# EAGLE design DevBrd (EAGLE 7.7.0)
DOKUMENT: Schaltplan; EDITOR: Simon Diehl; REFERENZ: Developmentboard; STATUS: In Entwicklung

## Sheet 1 of 2
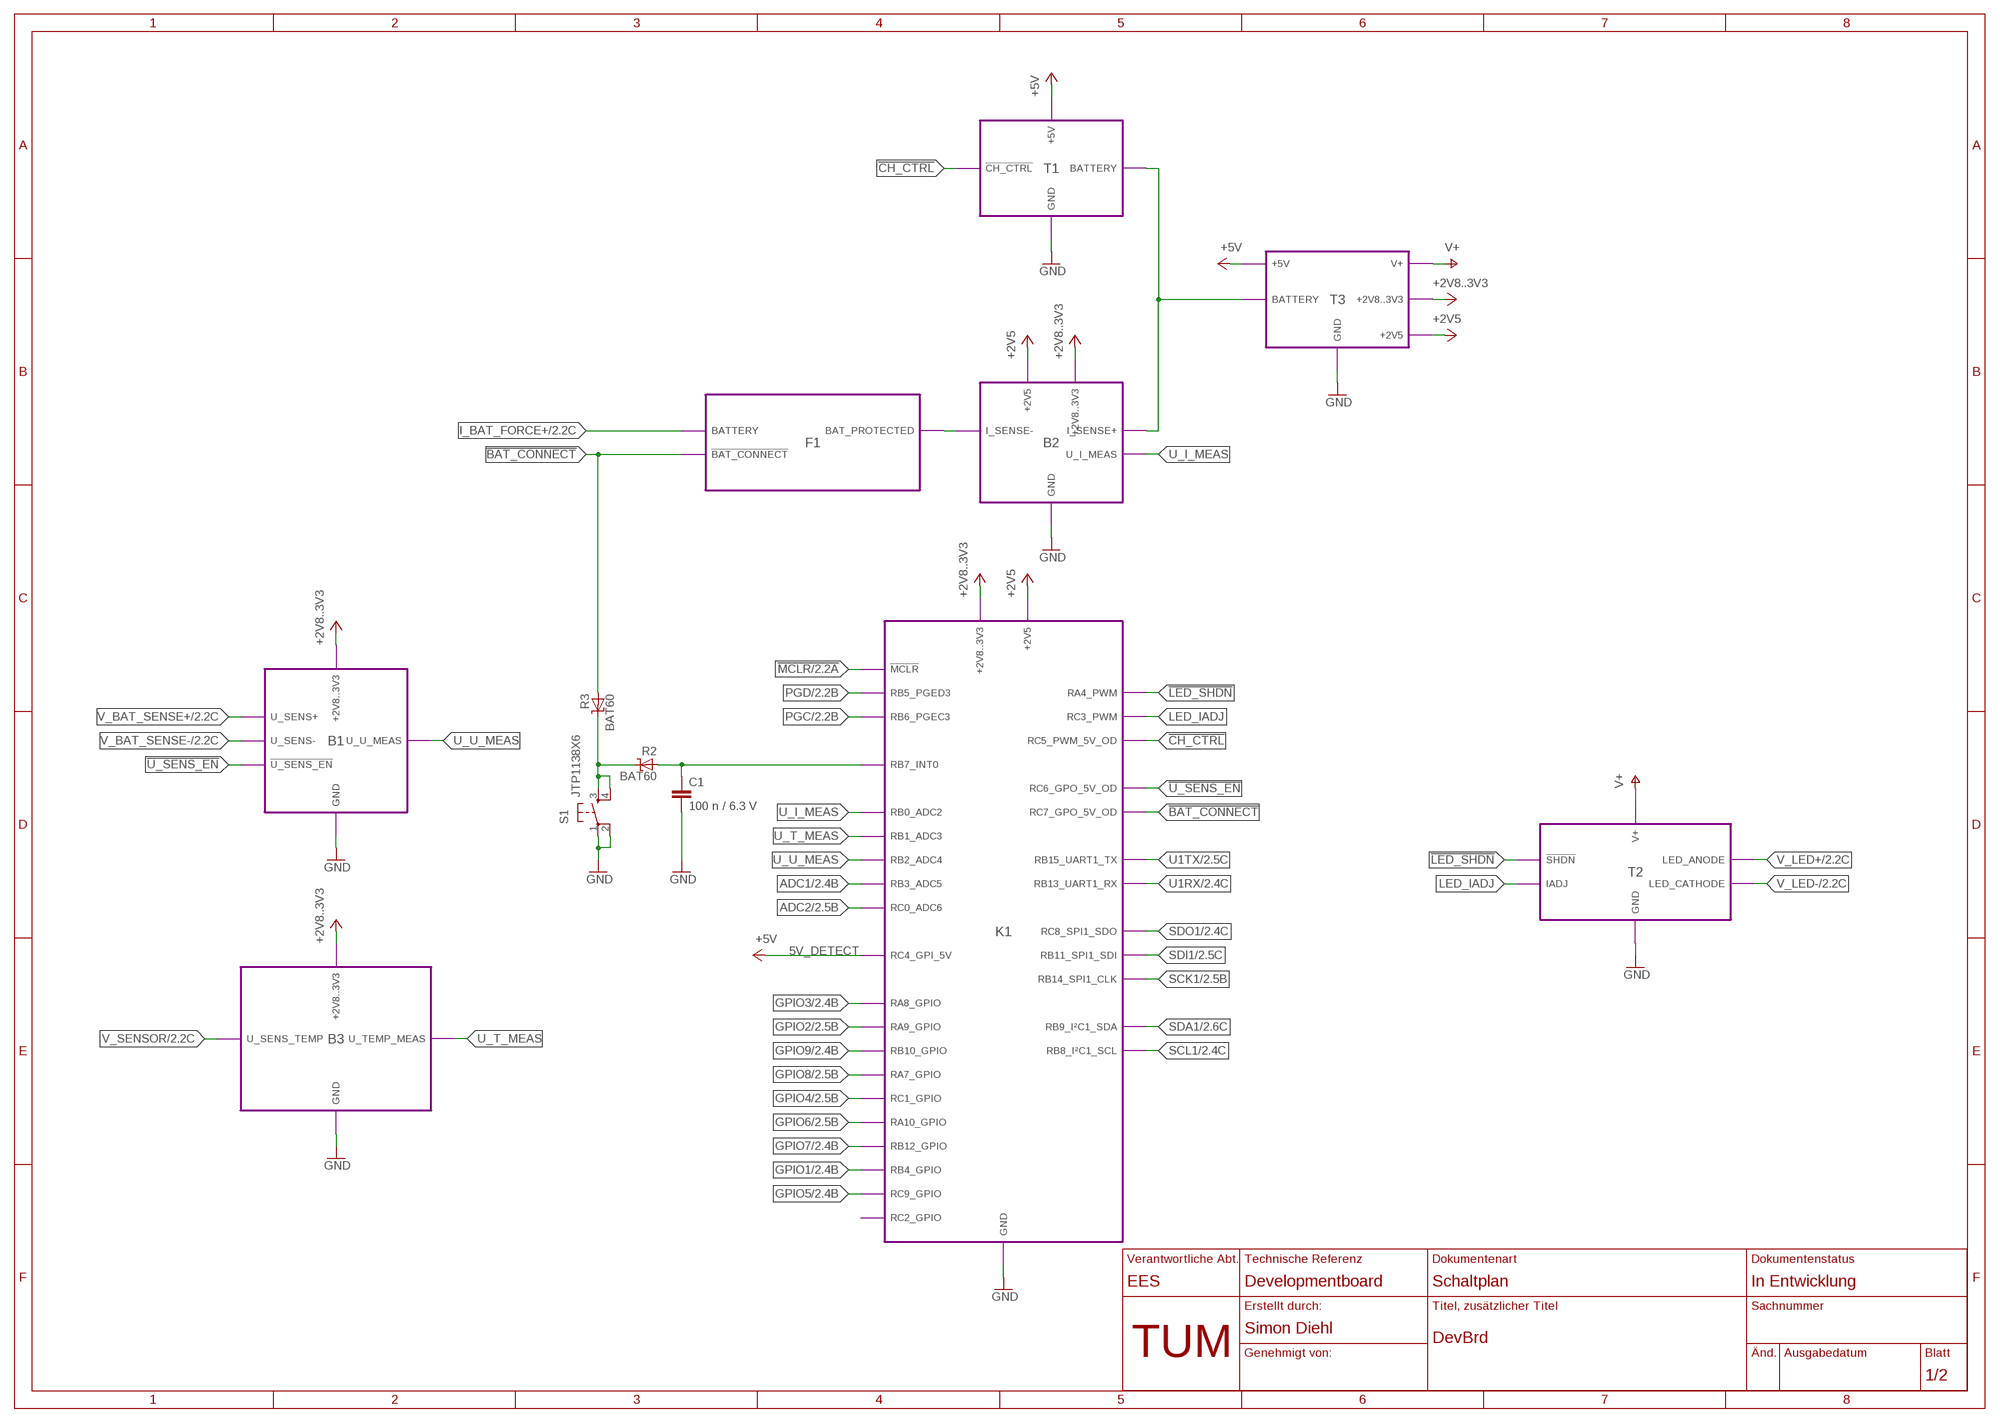
[diagram p0: schematic, sheet 1]

### Parts
C1  100 n / 6.3 V  C-EUC0603  [C0603]
R2  BAT60  [SOD323]
R3  BAT60  [SOD323]
S1  JTP1138X6  [JTP1138X6]

### Module instances
T3 = POWER_SUPPLY
T1 = CHARGER
T2 = LED_DRIVER
B3 = TEMPERATURE_SENSOR
K1 = PIC32MX
B1 = VOLTAGE_SENSOR
B2 = CURRENT_SENSOR
F1 = BATTERY_DISCONNECT

### Nets
!BAT_CONNECT: R3.A ; port F1.!BAT_CONNECT K1.RC7_GPO_5V_OD
!CH_CTRL: port T1.!CH_CTRL K1.RC5_PWM_5V_OD
!LED_SHDN: port K1.RA4_PWM T2.!SHDN
!MCLR: port K1.!MCLR ; also sheet 2
!U_SENS_EN: port B1.!U_SENS_EN K1.RC6_GPO_5V_OD
+2V5: port T3.+2V5 K1.+2V5 B2.+2V5
+2V8..3V3: port T3.+2V8..3V3 B3.+2V8..3V3 B1.+2V8..3V3 K1.+2V8..3V3 B2.+2V8..3V3 ; also sheet 2
+5V: port T3.+5V T1.+5V K1.RC4_GPI_5V ; also sheet 2
ADC1: port K1.RB3_ADC5 ; also sheet 2
ADC2: port K1.RC0_ADC6 ; also sheet 2
GND: C1.2 S1.1(P) S1.2(P1) ; port T3.GND T1.GND B2.GND T2.GND B3.GND B1.GND K1.GND ; also sheet 2
GPIO1: port K1.RB4_GPIO ; also sheet 2
GPIO2: port K1.RA9_GPIO ; also sheet 2
GPIO3: port K1.RA8_GPIO ; also sheet 2
GPIO4: port K1.RC1_GPIO ; also sheet 2
GPIO5: port K1.RC9_GPIO ; also sheet 2
GPIO6: port K1.RA10_GPIO ; also sheet 2
GPIO7: port K1.RB12_GPIO ; also sheet 2
GPIO8: port K1.RA7_GPIO ; also sheet 2
GPIO9: port K1.RB10_GPIO ; also sheet 2
I_BAT_FORCE+: port F1.BATTERY ; also sheet 2
LED_IADJ: port T2.IADJ K1.RC3_PWM
N$1: port F1.BAT_PROTECTED B2.I_SENSE-
N$2: port T1.BATTERY T3.BATTERY B2.I_SENSE+
N$3: C1.1 R2.A ; port K1.RB7_INT0
N$4: R2.C R3.C S1.3(S) S1.4(S1)
PGC: port K1.RB6_PGEC3 ; also sheet 2
PGD: port K1.RB5_PGED3 ; also sheet 2
SCK1: port K1.RB14_SPI1_CLK ; also sheet 2
SCL1: port K1.RB8_I²C1_SCL ; also sheet 2
SDA1: port K1.RB9_I²C1_SDA ; also sheet 2
SDI1: port K1.RB11_SPI1_SDI ; also sheet 2
SDO1: port K1.RC8_SPI1_SDO ; also sheet 2
U1RX: port K1.RB13_UART1_RX ; also sheet 2
U1TX: port K1.RB15_UART1_TX ; also sheet 2
U_I_MEAS: port B2.U_I_MEAS K1.RB0_ADC2
U_T_MEAS: port K1.RB1_ADC3 B3.U_TEMP_MEAS
U_U_MEAS: port B1.U_U_MEAS K1.RB2_ADC4
V+: port T3.V+ T2.V+
V_BAT_SENSE+: port B1.U_SENS+ ; also sheet 2
V_BAT_SENSE-: port B1.U_SENS- ; also sheet 2
V_LED+: port T2.LED_ANODE ; also sheet 2
V_LED-: port T2.LED_CATHODE ; also sheet 2
V_SENSOR: port B3.U_SENS_TEMP ; also sheet 2

### Notes on the sheet
- 5V_DETECT

## Sheet 2 of 2
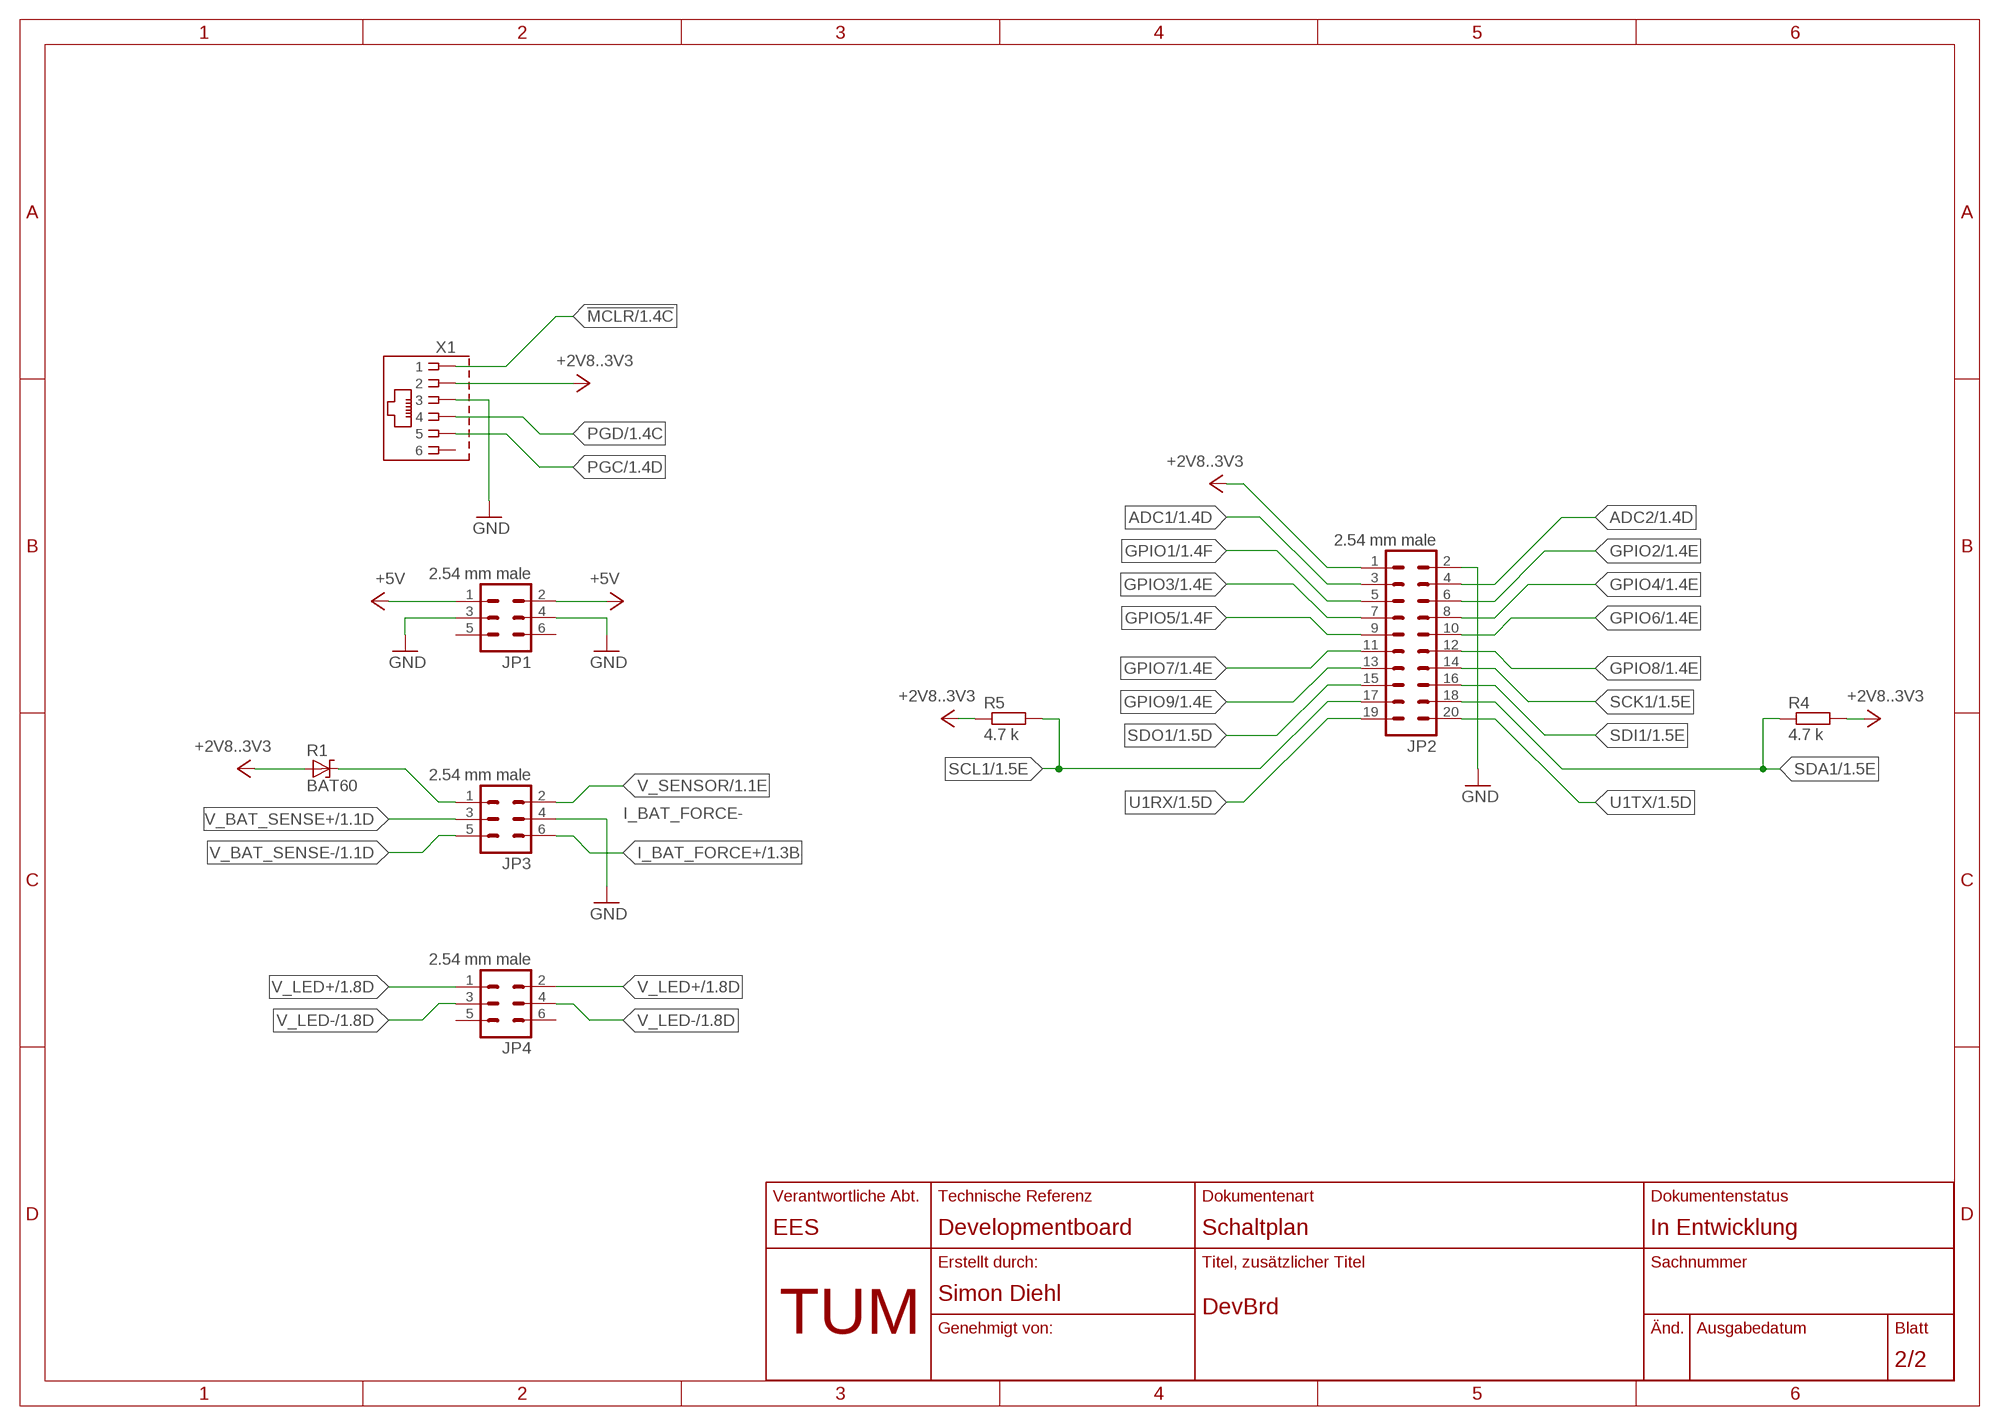
[diagram p1: schematic, sheet 2]

### Parts
JP1  2.54 mm male  ML6  [ML6]
JP2  2.54 mm male  ML20  [ML20]
JP3  2.54 mm male  ML6  [ML6]
JP4  2.54 mm male  ML6  [ML6]
R1  BAT60  [SOD323]
R4  4.7 k  R-EU_R0603  [R0603]
R5  4.7 k  R-EU_R0603  [R0603]
X1  RJ11WüRTH  [XRJK-S-01-6-6-0-2G2-NO]

### Nets
!MCLR: X1.6 ; also sheet 1
+2V8..3V3: JP2.1 R1.A R4.2 R5.1 X1.5 ; also sheet 1
+5V: JP1.1 JP1.2 ; also sheet 1
ADC1: JP2.3 ; also sheet 1
ADC2: JP2.4 ; also sheet 1
GND: JP1.3 JP1.4 JP2.2 JP3.4 X1.4 ; also sheet 1
GPIO1: JP2.5 ; also sheet 1
GPIO2: JP2.6 ; also sheet 1
GPIO3: JP2.7 ; also sheet 1
GPIO4: JP2.8 ; also sheet 1
GPIO5: JP2.9 ; also sheet 1
GPIO6: JP2.10 ; also sheet 1
GPIO7: JP2.11 ; also sheet 1
GPIO8: JP2.12 ; also sheet 1
GPIO9: JP2.13 ; also sheet 1
I_BAT_FORCE+: JP3.6 ; also sheet 1
PGC: X1.2 ; also sheet 1
PGD: X1.3 ; also sheet 1
SCK1: JP2.14 ; also sheet 1
SCL1: JP2.17 R5.2 ; also sheet 1
SDA1: JP2.18 R4.1 ; also sheet 1
SDI1: JP2.16 ; also sheet 1
SDO1: JP2.15 ; also sheet 1
U1RX: JP2.19 ; also sheet 1
U1TX: JP2.20 ; also sheet 1
V_BAT_SENSE+: JP3.3 ; also sheet 1
V_BAT_SENSE-: JP3.5 ; also sheet 1
V_LED+: JP4.1 JP4.2 ; also sheet 1
V_LED-: JP4.3 JP4.4 ; also sheet 1
V_SENSOR: JP3.2 ; also sheet 1
VDD_SENSOR: JP3.1 R1.C
Unconnected: JP1.5 JP1.6 JP4.5 JP4.6 X1.1

### Notes on the sheet
- I_BAT_FORCE-

## Library data of the parts
C1 = rcl:C-EU: CAPACITOR, European symbol
JP1 JP3 JP4 = Development_Board:ML6: HARTING; OC_FARNELL: unknown; OC_NEWARK: unknown
JP2 = Development_Board:ML20: HARTING; OC_FARNELL: unknown; OC_NEWARK: unknown
R1-R3 = Development_Board:BAT60: Schottky barrier diode Source: www.st.com, BAT60J.pdf
R4 R5 = rcl@1:R-EU_: RESISTOR, European symbol; SPICEPREFIX: R
S1 = Development_Board:JTP1138X6
X1 = WürthRJ11:RJ11WüRTH: RJ11 Connector HORIZONTAL PLASTIC 6P6C MODULAR JACK

## Module POWER_SUPPLY
Ports: +5V(pwr) BATTERY(pwr) GND(pwr) V+(pwr) +2V8..3V3(pwr) +2V5(pwr)
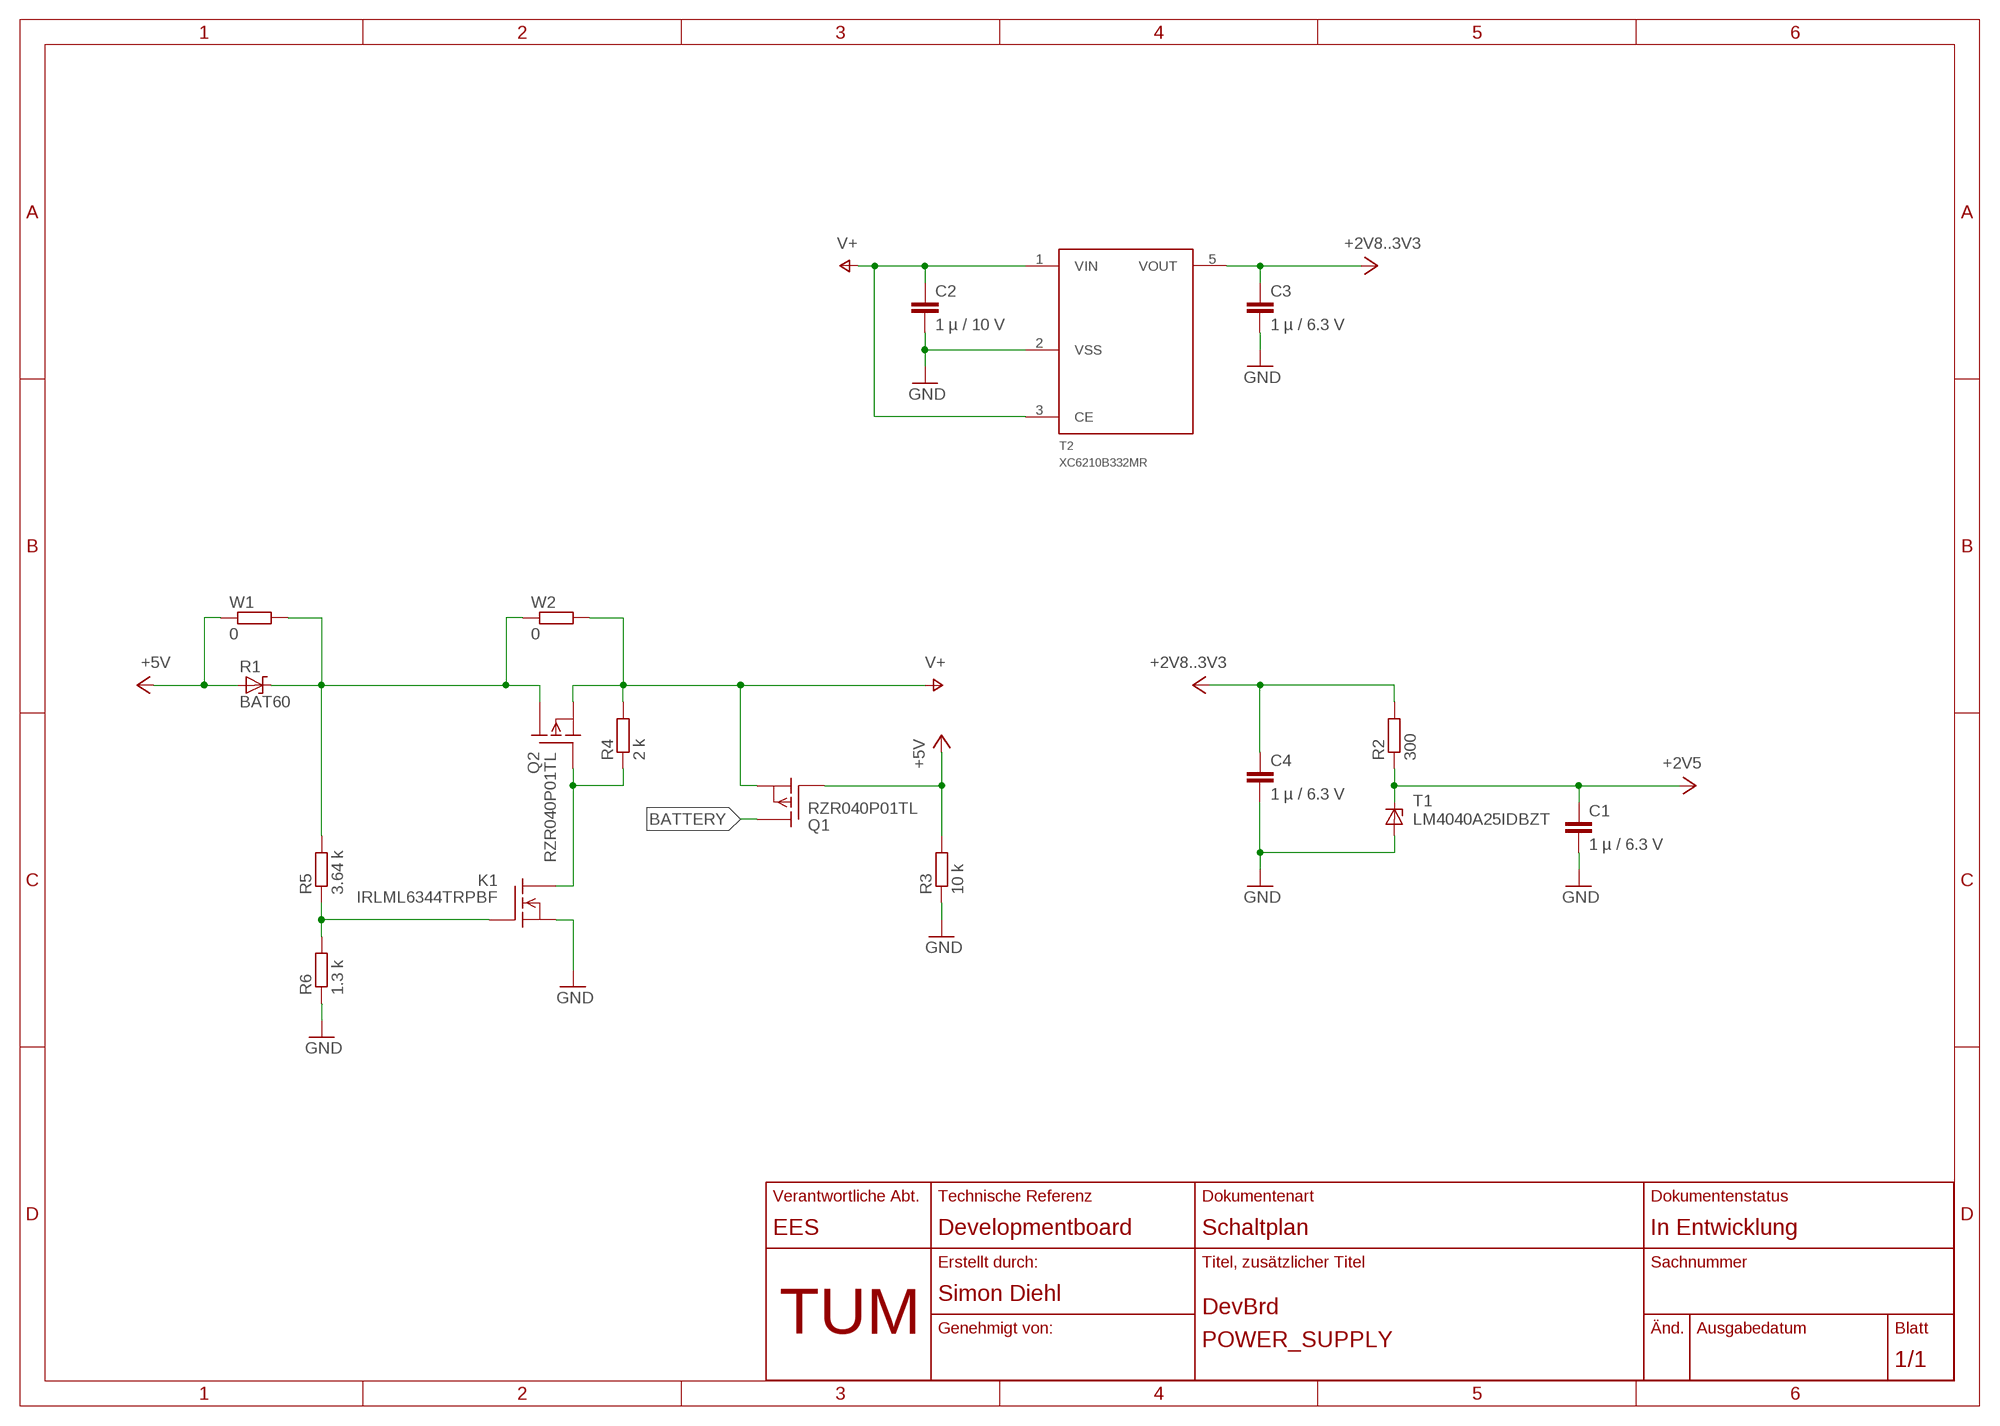
[diagram p2: schematic, module POWER_SUPPLY, sheet 1]

### Parts
C1  1 µ / 6.3 V  C-EUC0603  [C0603]
C2  1 µ / 10 V  C-EUC0603  [C0603]
C3  1 µ / 6.3 V  C-EUC0603  [C0603]
C4  1 µ / 6.3 V  C-EUC0603  [C0603]
K1  IRLML6344TRPBF  [SOT-23-3]
Q1  RZR040P01TL  [SOT-23-3]
Q2  RZR040P01TL  [SOT-23-3]
R1  BAT60  [SOD323]
R2  300  R-EU_R0603  [R0603]
R3  10 k  R-EU_R0603  [R0603]
R4  2 k  R-EU_R0603  [R0603]
R5  3.64 k  R-EU_R0603  [R0603]
R6  1.3 k  R-EU_R0603  [R0603]
T1  LM4040A25IDBZT  [DBZ_R-PDSO-G3]
T2  XC6210B332MR  [SOT-23-5L]
W1  0  R-EU_R0603  [R0603]
W2  0  R-EU_R0603  [R0603]

### Nets
+2V5: C1.1 R2.1 T1.1(C)
+2V8..3V3: C3.1 C4.1 R2.2 T2.5(VOUT)
+5V: Q1.1(G) R1.A R3.2 W1.1
BATTERY: Q1.3(D)
GND: C1.2 C2.2 C3.2 C4.2 K1.2(S) R3.1 R6.1 T1.2(A) T2.2(VSS)
N$1: Q2.3(D) R1.C R5.2 W1.2 W2.1
N$2: K1.3(D) Q2.1(G) R4.1
N$3: K1.1(G) R5.1 R6.2
V+: C2.1 Q1.2(S) Q2.2(S) R4.2 T2.1(VIN) T2.3(CE) W2.2

### Library data of the parts
C1-C4 = rcl:C-EU: CAPACITOR, European symbol
K1 = Development_Board:IRLML6344TRPBF
Q1 Q2 = Development_Board:RZR040P01TL
R1 = Development_Board:BAT60: Schottky barrier diode Source: www.st.com, BAT60J.pdf
R2-R6 W1 W2 = rcl:R-EU_: RESISTOR, European symbol
T1 = Development_Board:LM4040*I; ACCURACY: 0,1%; VKA: 2,5V
T2 = Development_Board:XC6210B332: XC6210 High Current, High Speed LDO Regulators Maximum Output Current : More than 700mA (800mA limit, TYP.) Dropout Voltage : 50mV @ 100mA : 100mV @ 200mA Operating Voltage Range : 1.5V ~ 6.0V Output Voltage Range : 0.8V ~ 5.0V (0.05V increments) Highly Accurate : +2%(The setting voltage accuracy) Low Power Consumption : 35 µA (TYP.) High Ripple Rejection : 60dB @1kHz Operational Ambient Temperature: - 40 °C ~ 85 °C CMOS Low ESR Capacitor Compatible Packages : SOT-25, SOT-89-5, USP-6B; EES_ID: 00001156; MANUFACTOR: Torex; MPN: XC6210B332MR; OC_FARNELL: 1057803

## Module CHARGER
Ports: +5V(pwr) GND(pwr) BATTERY(pwr) !CH_CTRL(pas)
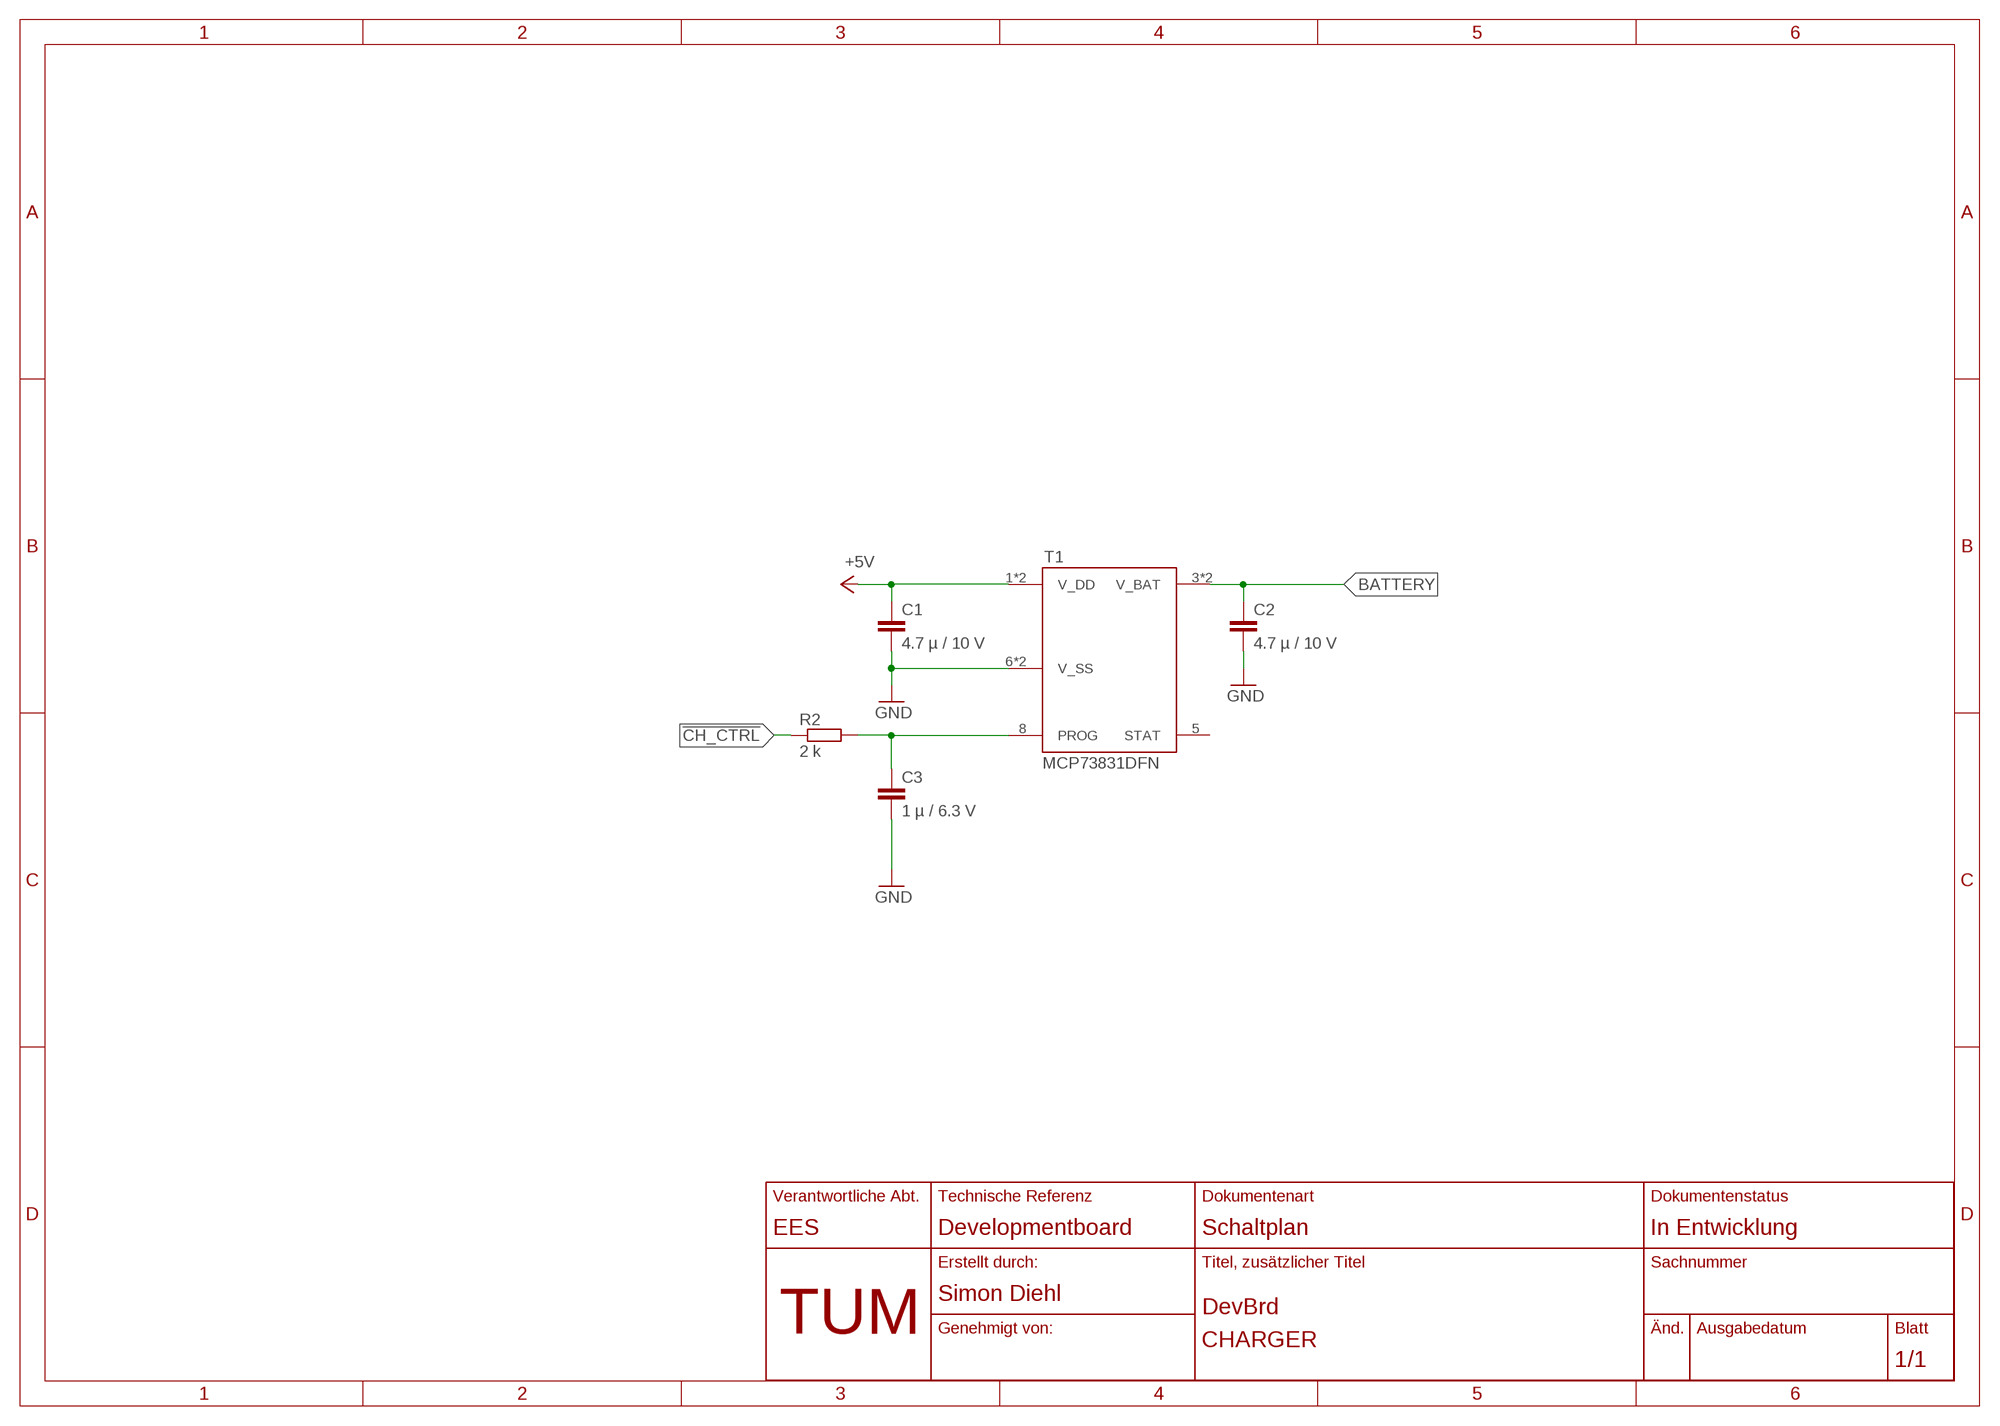
[diagram p3: schematic, module CHARGER, sheet 1]

### Parts
C1  4.7 µ / 10 V  C-EUC0805  [C0805]
C2  4.7 µ / 10 V  C-EUC0805  [C0805]
C3  1 µ / 6.3 V  C-EUC0603  [C0603]
R2  2 k  R-EU_R0603  [R0603]
T1  MCP73831DFN  [MCP73831_DFN]

### Nets
!CH_CTRL: R2.1
+5V: C1.1 T1.1(V_DD) T1.2(V_DD)
BATTERY: C2.1 T1.3(V_BAT) T1.4(V_BAT)
GND: C1.2 C2.2 C3.2 T1.6(V_SS) T1.9(V_SS)
N$2: C3.1 R2.2 T1.8(PROG)
Unconnected: T1.5(STAT)

### Library data of the parts
C1-C3 = rcl:C-EU: CAPACITOR, European symbol
R2 = rcl:R-EU_: RESISTOR, European symbol
T1 = Development_Board:MCP73831: Microchip 1-cell LIPO charger

## Module CURRENT_SENSOR
Ports: GND(pwr) I_SENSE+(pas) I_SENSE-(pas) U_I_MEAS(out) +2V8..3V3(pwr) +2V5(pwr)
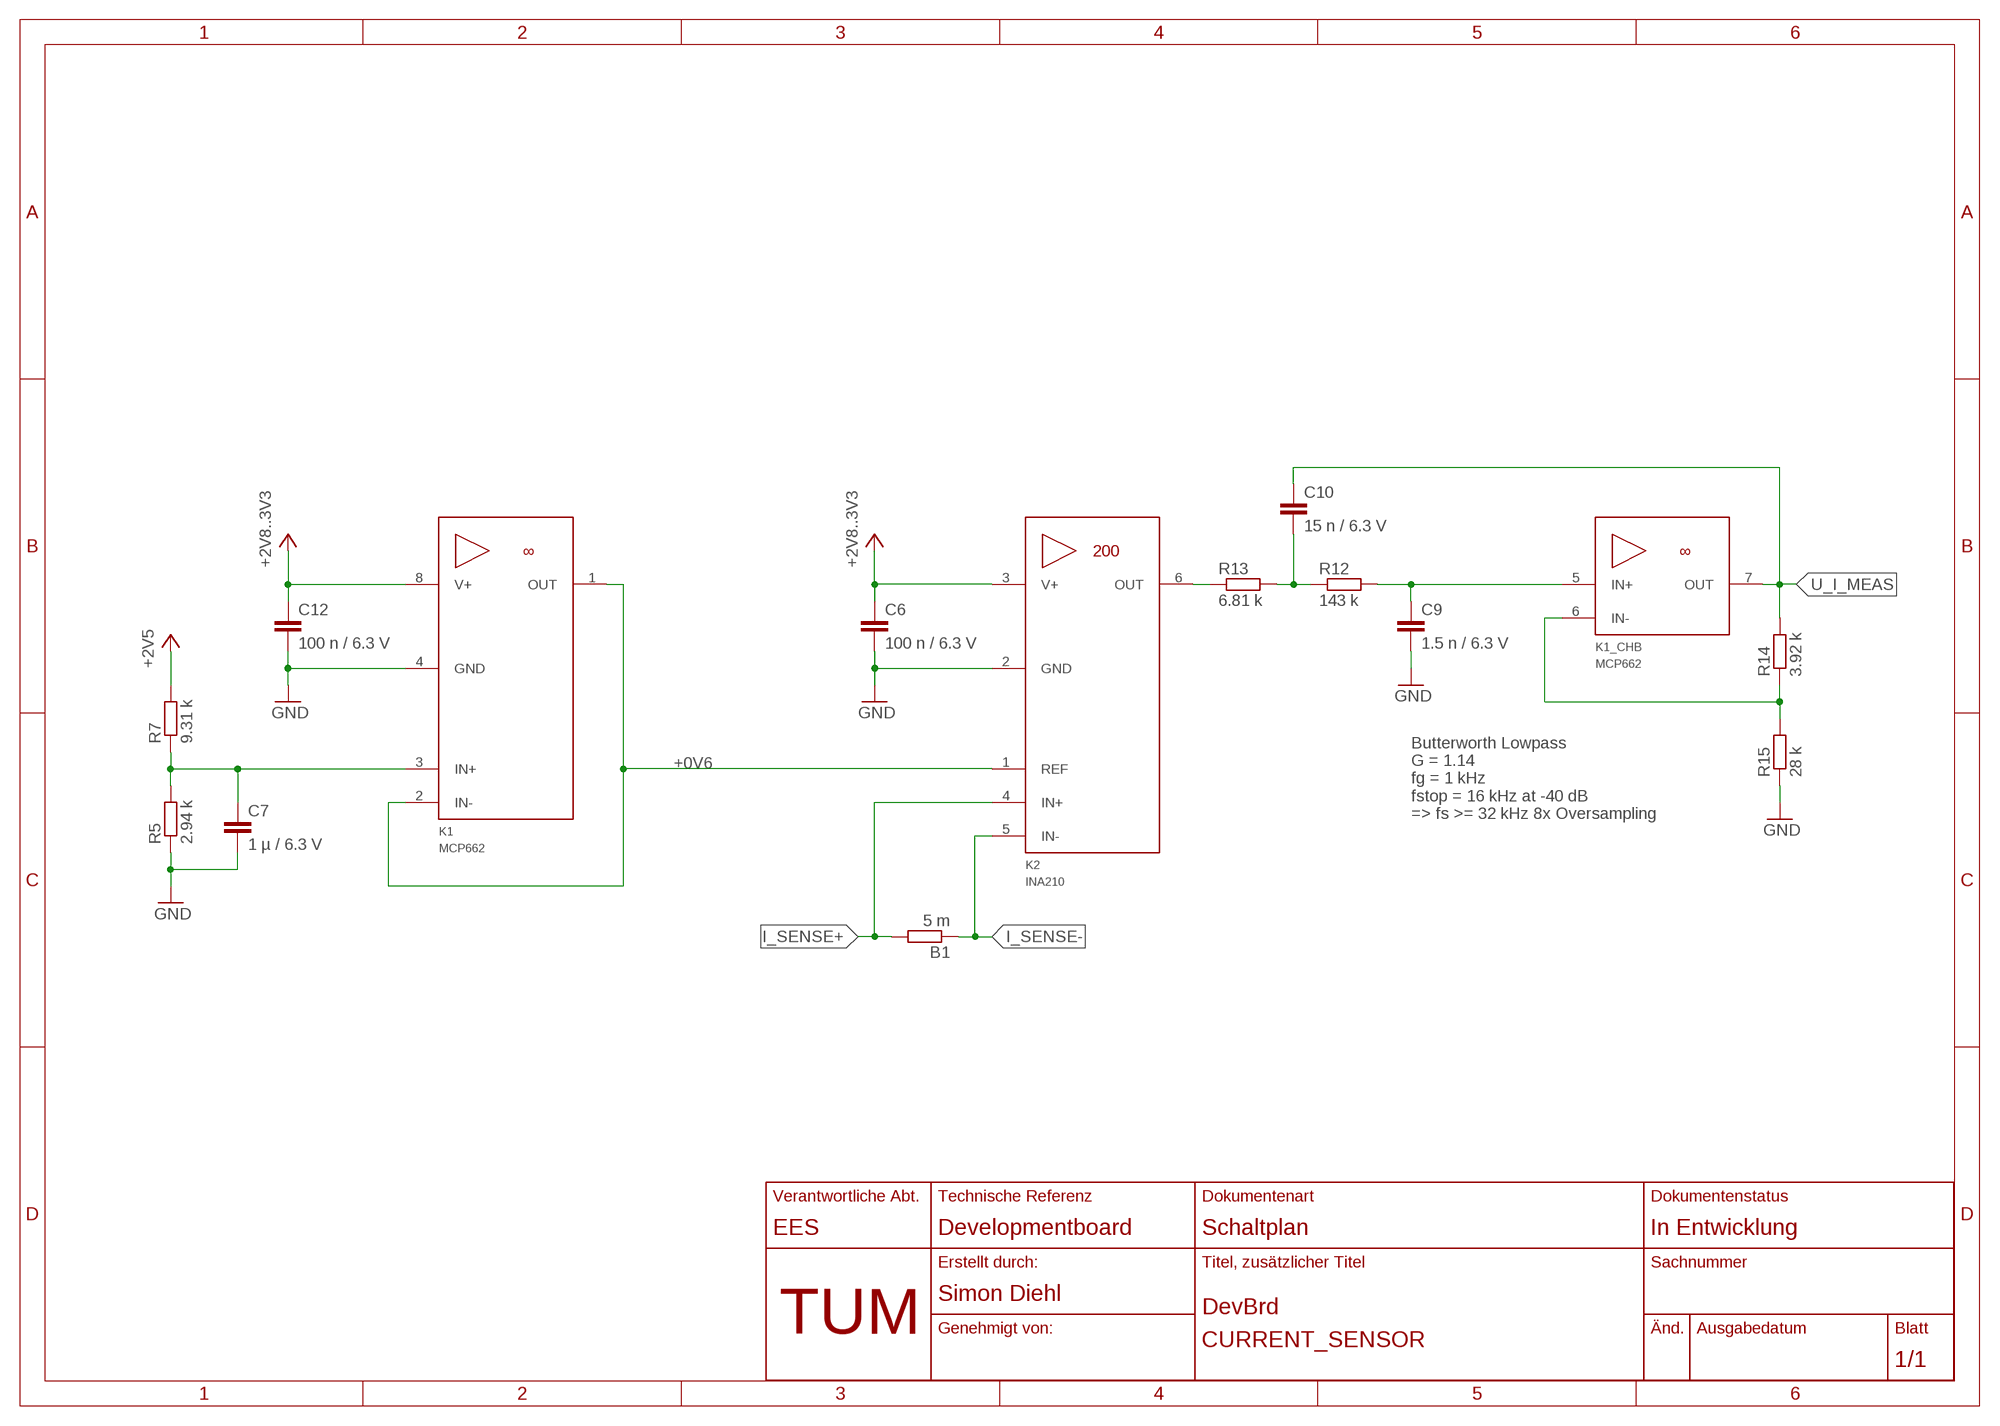
[diagram p4: schematic, module CURRENT_SENSOR, sheet 1]

### Parts
B1  5 m  R-EU_R2512W  [R2512W]
C6  100 n / 6.3 V  C-EUC0603  [C0603]
C7  1 µ / 6.3 V  C-EUC0603  [C0603]
C9  1.5 n / 6.3 V  C-EUC0603  [C0603]
C10  15 n / 6.3 V  C-EUC0603  [C0603]
C12  100 n / 6.3 V  C-EUC0603  [C0603]
K1  MCP662  [SO-8]
K2  INA210  INA210_DCK_  [SC70-6]
R5  2.94 k  R-EU_R0603  [R0603]
R7  9.31 k  R-EU_R0603  [R0603]
R12  143 k  R-EU_R0603  [R0603]
R13  6.81 k  R-EU_R0603  [R0603]
R14  3.92 k  R-EU_R0603  [R0603]
R15  28 k  R-EU_R0603  [R0603]

### Nets
+0V6: K1.1(OUT) K1.2(IN-) K2.1(REF)
+2V5: R7.2
+2V8..3V3: C6.1 C12.1 K1.8(V+) K2.3(V+)
GND: C6.2 C7.2 C9.2 C12.2 K1.4(GND) K2.2(GND) R5.1 R15.1
I_SENSE+: B1.2 K2.4(IN+)
I_SENSE-: B1.1 K2.5(IN-)
N$1: C7.1 K1.3(IN+) R5.2 R7.1
N$4: K2.6(OUT) R13.1
N$12: C9.1 K1.5(IN+) R12.2
N$13: C10.2 R12.1 R13.2
N$14: K1.6(IN-) R14.1 R15.2
U_I_MEAS: C10.1 K1.7(OUT) R14.2

### Notes on the sheet
- Butterworth Lowpass
  G = 1.14
  fg = 1 kHz
  fstop = 16 kHz at -40 dB
  => fs >= 32 kHz 8x Oversampling

### Library data of the parts
B1 R5 R7 R12-R15 = rcl:R-EU_: RESISTOR, European symbol
C6 C7 C9 C10 C12 = rcl:C-EU: CAPACITOR, European symbol
K1 = Development_Board:MCP66*
K2 = Development_Board:INA21*_?_: Voltage Output, Low- or High-Side Measurement, Bidirectional, Zero-Drift Series, Current-Shunt Monitors Datasheet <http://www.ti.com/lit/ds/symlink/ina212.pdf>; GAIN: 200

## Module LED_DRIVER
Ports: V+(pwr) GND(pwr) !SHDN(in) IADJ(in) LED_ANODE(pwr) LED_CATHODE(pwr)
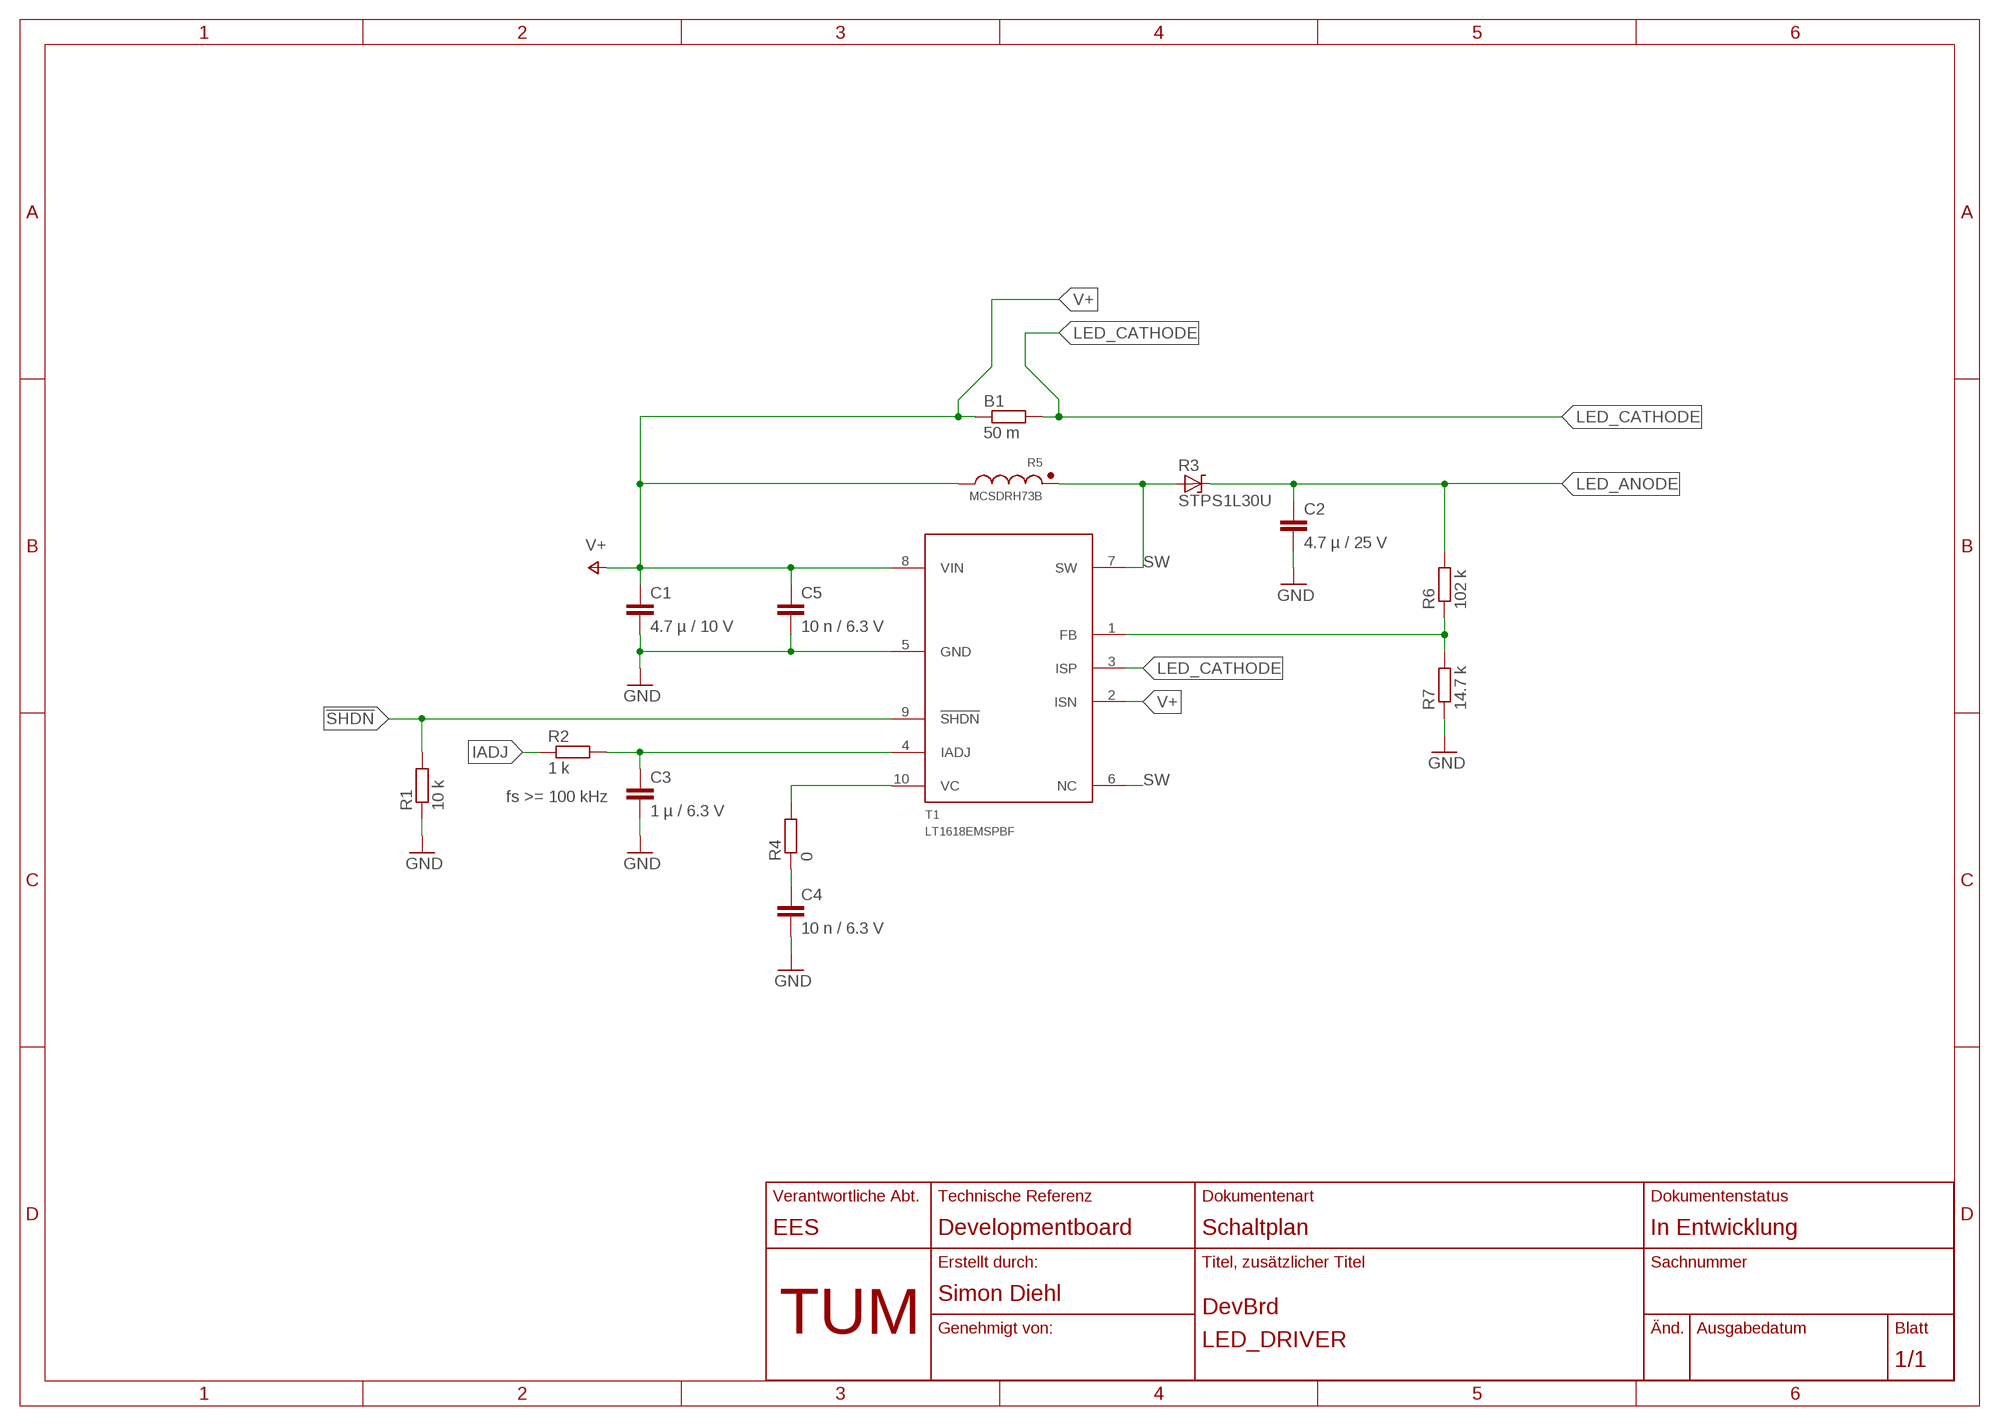
[diagram p5: schematic, module LED_DRIVER, sheet 1]

### Parts
B1  50 m  R-EU_R2512W  [R2512W]
C1  4.7 µ / 10 V  C-EUC0805  [C0805]
C2  4.7 µ / 25 V  C-EUC0805  [C0805]
C3  1 µ / 6.3 V  C-EUC0603  [C0603]
C4  10 n / 6.3 V  C-EUC0603  [C0603]
C5  10 n / 6.3 V  C-EUC0603  [C0603]
R1  10 k  R-EU_R0603  [R0603]
R2  1 k  R-EU_R0603  [R0603]
R3  STPS1L30U  [DO214AA]
R4  0  R-EU_R0603  [R0603]
R5  MCSDRH73B  [MCSDRH73B]
R6  102 k  R-EU_R0603  [R0603]
R7  14.7 k  R-EU_R0603  [R0603]
T1  LT1618EMSPBF  [SOP50P490X110-10N]

### Nets
!SHDN: R1.2 T1.9(!SHDN)
GND: C1.2 C2.2 C3.2 C4.2 C5.2 R1.1 R7.1 T1.5(GND)
IADJ: R2.1
LED_ANODE: C2.1 R3.C R6.2
LED_CATHODE: B1.2 T1.3(ISP)
N$1: C3.1 R2.2 T1.4(IADJ)
N$2: R4.2 T1.10(VC)
N$3: C4.1 R4.1
N$6: R6.1 R7.2 T1.1(FB)
SW: R3.A R5.P$1 T1.6(NC) T1.7(SW)
V+: B1.1 C1.1 C5.1 R5.P$2 T1.2(ISN) T1.8(VIN)

### Notes on the sheet
- fs >= 100 kHz

### Library data of the parts
B1 R1 R2 R4 R6 R7 = rcl:R-EU_: RESISTOR, European symbol
C1-C5 = rcl:C-EU: CAPACITOR, European symbol
R3 = Development_Board:STPS1L30U
R5 = Development_Board:MCSDRH73B
T1 = Development_Board:LT1618EMSPBF: Constant-Current/Constant-Voltage 1.4MHz Step-Up DC/DC Converter; EES_ID: 00001201; MANUFACTOR: Linear Technologie; MPN: LT1618EMS#PBF; OC_FARNELL: 1273771; OC_NEWARK: 57M5248; PACKAGE: MSOP-10

## Module TEMPERATURE_SENSOR
Ports: GND(pwr) +2V8..3V3(pwr) U_SENS_TEMP(in) U_TEMP_MEAS(out)
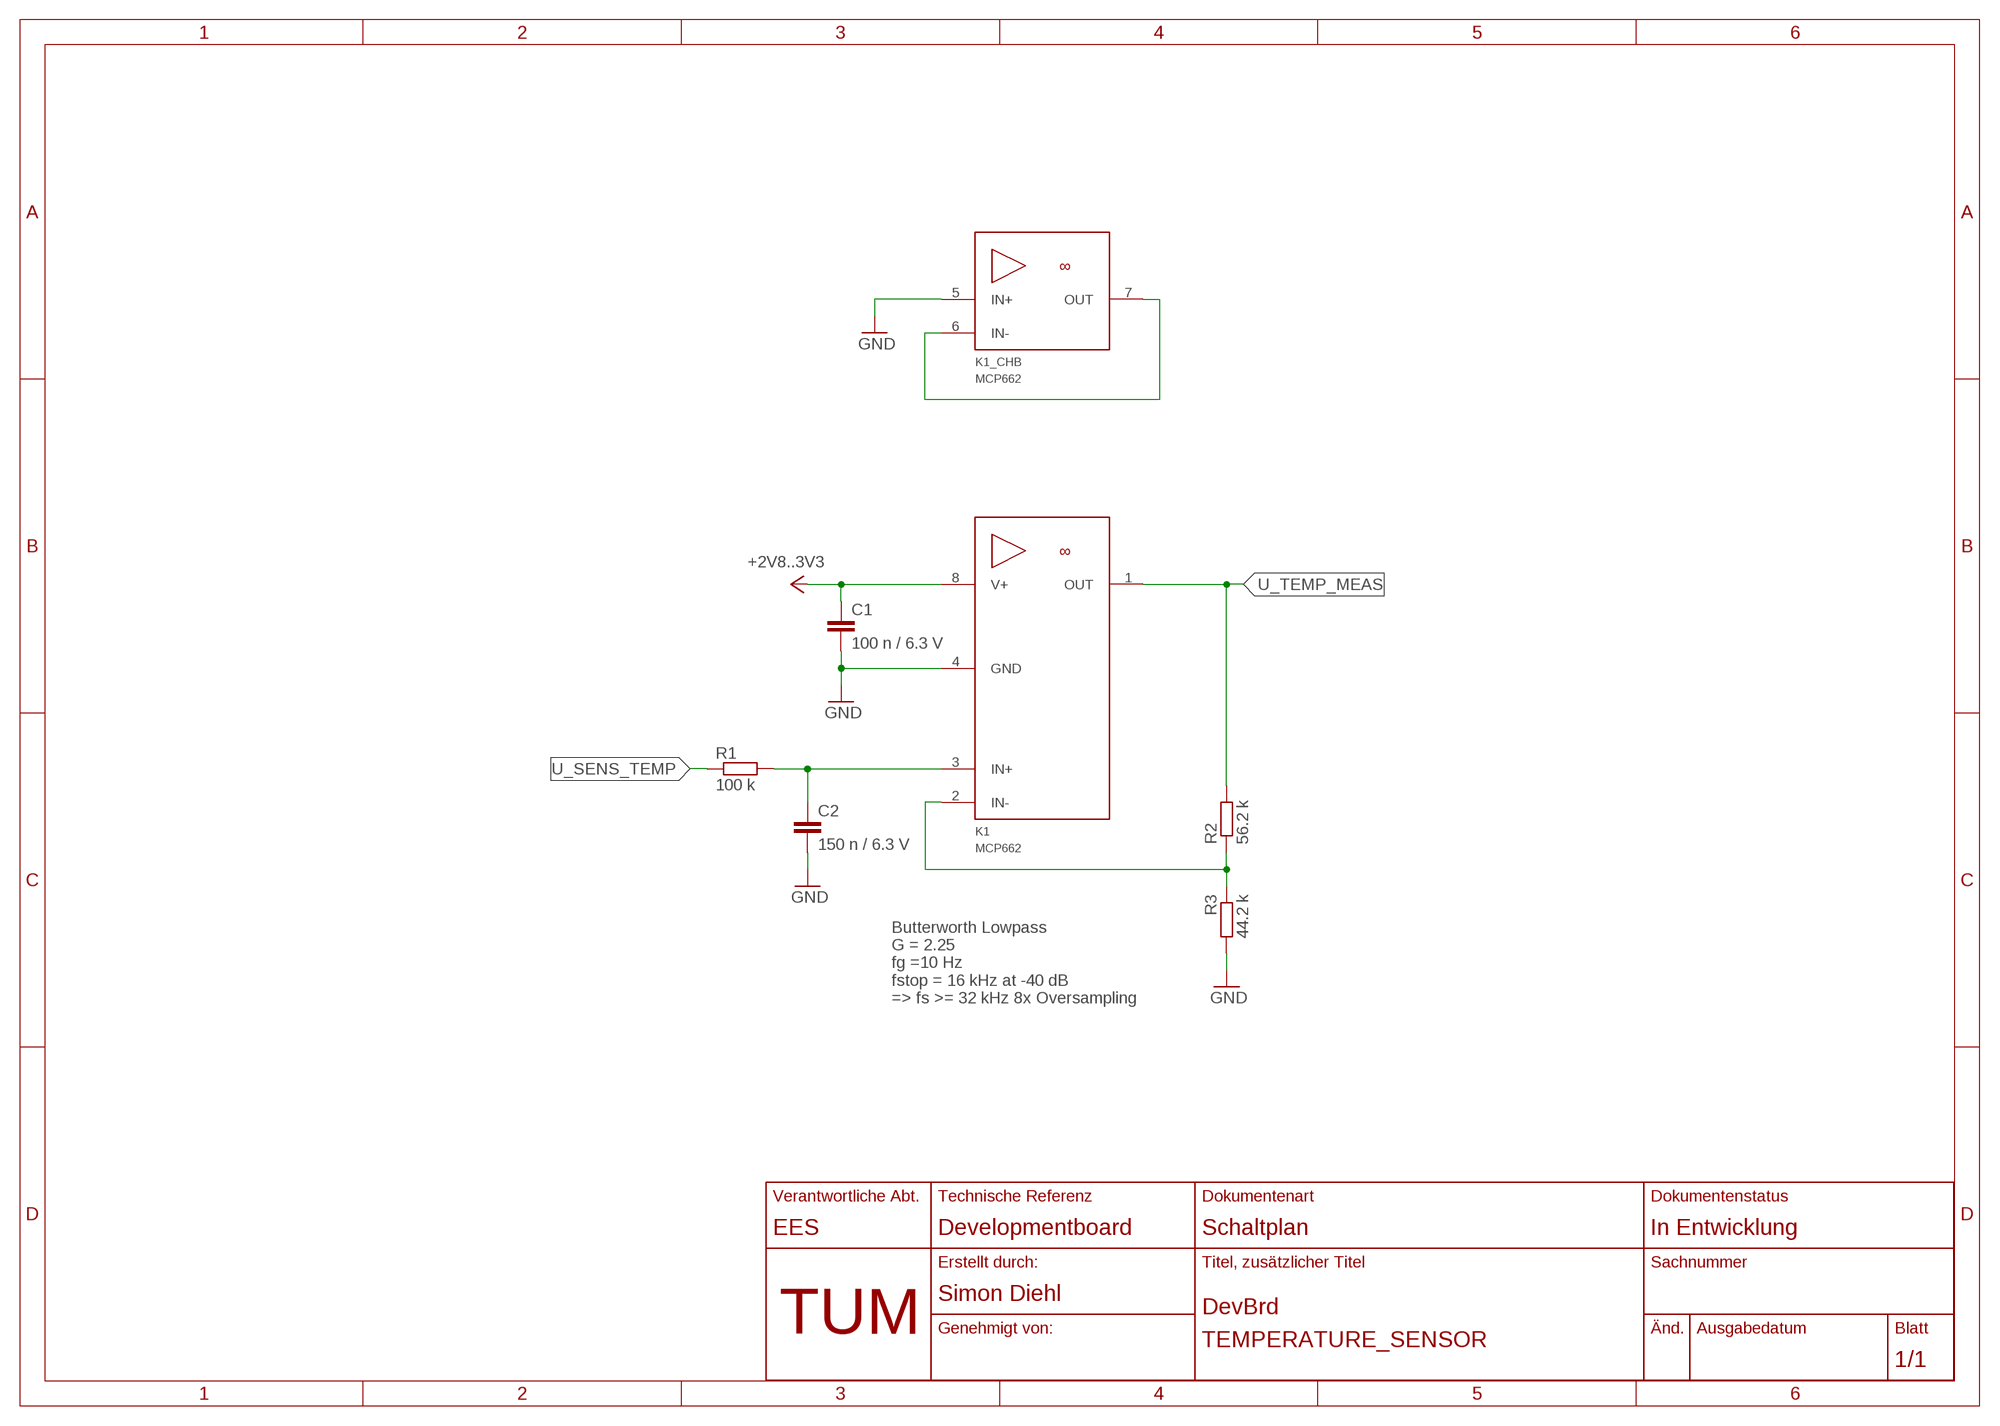
[diagram p6: schematic, module TEMPERATURE_SENSOR, sheet 1]

### Parts
C1  100 n / 6.3 V  C-EUC0603  [C0603]
C2  150 n / 6.3 V  C-EUC0603  [C0603]
K1  MCP662  [SO-8]
R1  100 k  R-EU_R0603  [R0603]
R2  56.2 k  R-EU_R0603  [R0603]
R3  44.2 k  R-EU_R0603  [R0603]

### Nets
+2V8..3V3: C1.1 K1.8(V+)
GND: C1.2 C2.2 K1.4(GND) K1.5(IN+) R3.2
N$1: K1.6(IN-) K1.7(OUT)
N$2: C2.1 K1.3(IN+) R1.2
N$4: K1.2(IN-) R2.1 R3.1
U_SENS_TEMP: R1.1
U_TEMP_MEAS: K1.1(OUT) R2.2

### Notes on the sheet
- Butterworth Lowpass
  G = 2.25
  fg =10 Hz
  fstop = 16 kHz at -40 dB
  => fs >= 32 kHz 8x Oversampling

### Library data of the parts
C1 C2 = rcl:C-EU: CAPACITOR, European symbol
K1 = Development_Board:MCP66*
R1-R3 = rcl:R-EU_: RESISTOR, European symbol

## Module BATTERY_DISCONNECT
Ports: !BAT_CONNECT(in) BATTERY(pwr) BAT_PROTECTED(pwr)
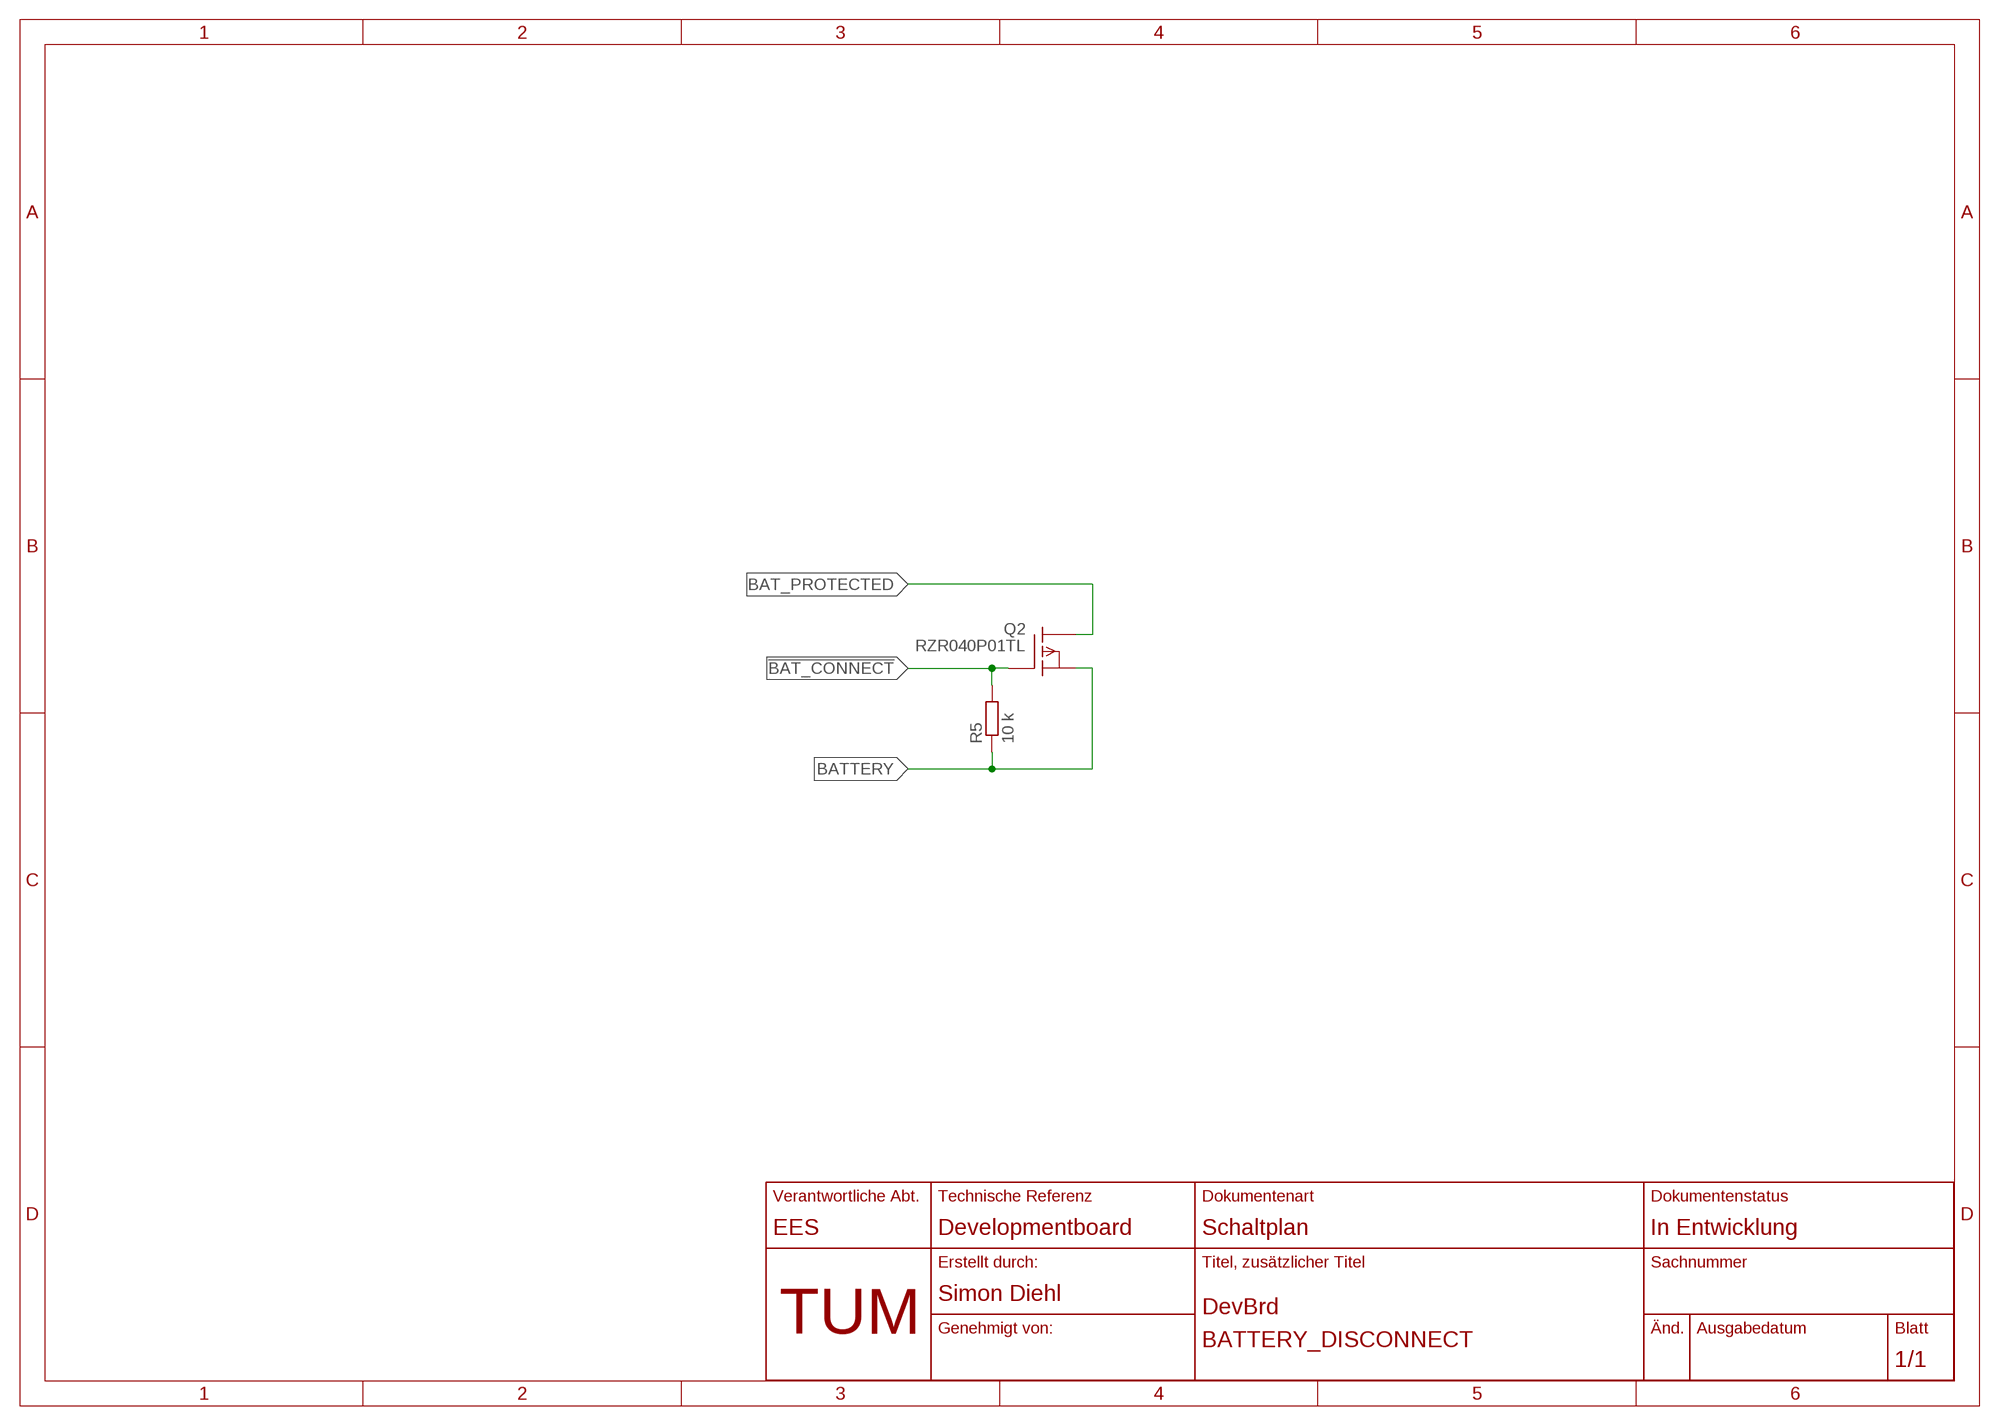
[diagram p7: schematic, module BATTERY_DISCONNECT, sheet 1]

### Parts
Q2  RZR040P01TL  [SOT-23-3]
R5  10 k  R-EU_R0603  [R0603]

### Nets
!BAT_CONNECT: Q2.1(G) R5.2
BAT_PROTECTED: Q2.3(D)
BATTERY: Q2.2(S) R5.1

### Library data of the parts
Q2 = Development_Board:RZR040P01TL
R5 = rcl:R-EU_: RESISTOR, European symbol

## Module PIC32MX
Ports: +2V5(pwr) +2V8..3V3(pwr) GND(pwr) RA4_PWM(out) RC6_GPO_5V_OD(oc) RA8_GPIO(io) RA9_GPIO(io) RB10_GPIO(io) RC1_GPIO(io) RC2_GPIO(io) RC5_PWM_5V_OD(pas) RC4_GPI_5V(in) RC7_GPO_5V_OD(pas) RB12_GPIO(io) RC9_GPIO(io) RB0_ADC2(in) RB1_ADC3(in) RB2_ADC4(in) RB3_ADC5(in) RC0_ADC6(in) RB9_I²C1_SDA(io) RB8_I²C1_SCL(out) RB14_SPI1_CLK(out) RB13_UART1_RX(in) RB6_PGEC3(in) RB5_PGED3(io) !MCLR(in) RB7_INT0(in) RB15_UART1_TX(io) RB11_SPI1_SDI(io) RC8_SPI1_SDO(io) RC3_PWM(io) RA7_GPIO(io) RA10_GPIO(io) RB4_GPIO(io)
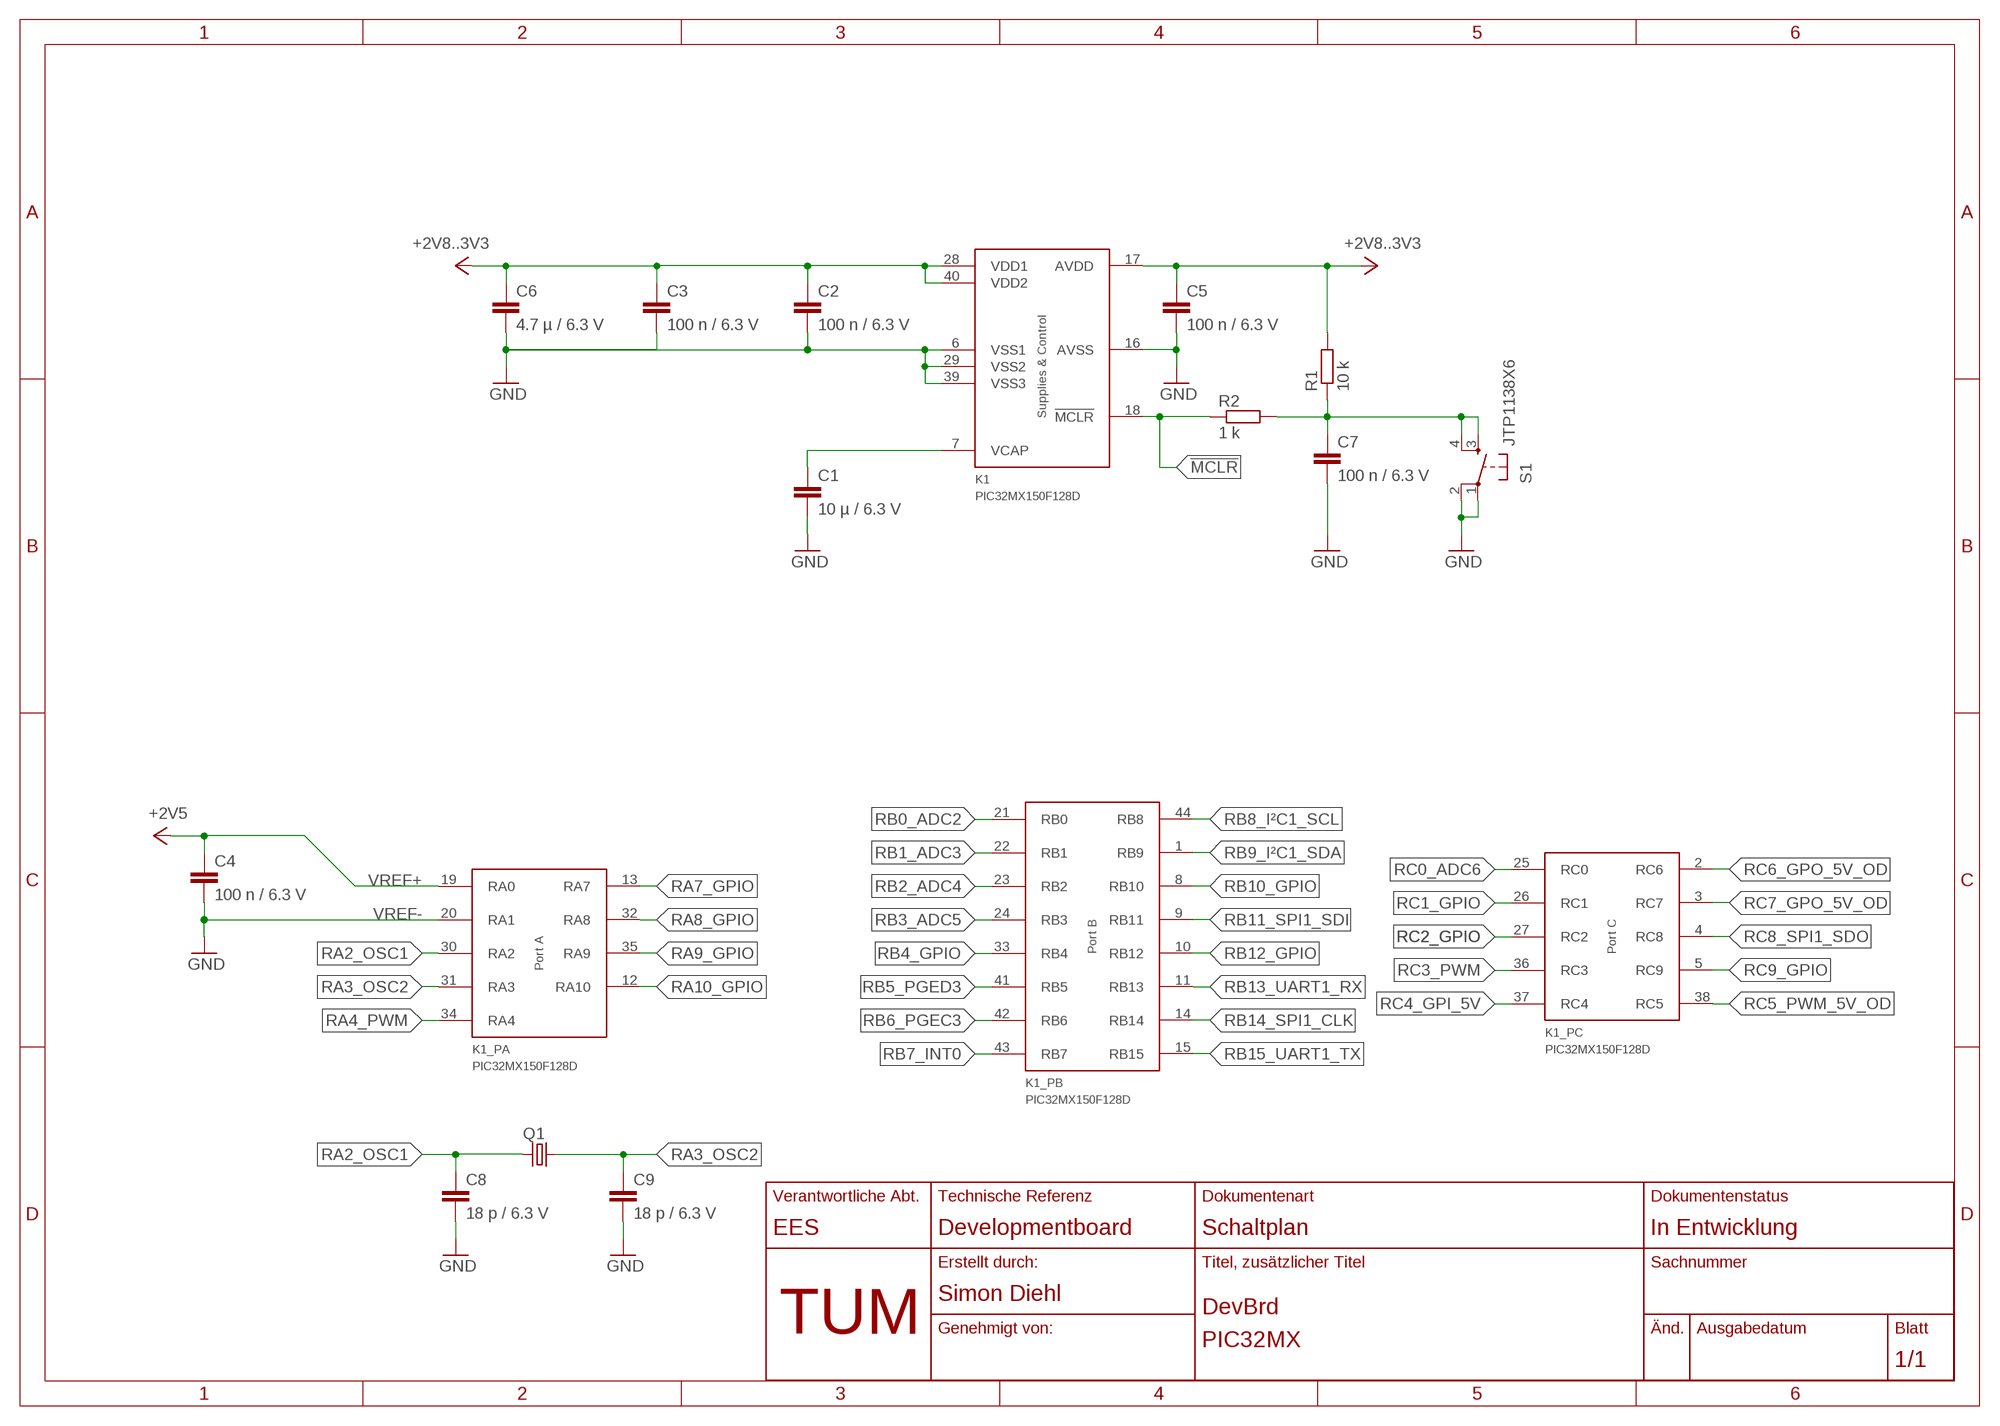
[diagram p8: schematic, module PIC32MX, sheet 1]

### Parts
C1  10 µ / 6.3 V  C-EUC0805  [C0805]
C2  100 n / 6.3 V  C-EUC0603  [C0603]
C3  100 n / 6.3 V  C-EUC0603  [C0603]
C4  100 n / 6.3 V  C-EUC0603  [C0603]
C5  100 n / 6.3 V  C-EUC0603  [C0603]
C6  4.7 µ / 6.3 V  C-EUC0805  [C0805]
C7  100 n / 6.3 V  C-EUC0603  [C0603]
C8  18 p / 6.3 V  C-EUC0603  [C0603]
C9  18 p / 6.3 V  C-EUC0603  [C0603]
K1  PIC32MX150F128D  [TQFP-44]
Q1  ABM3ABM3  [ABM3]
R1  10 k  R-EU_R0603  [R0603]
R2  1 k  R-EU_R0603  [R0603]
S1  JTP1138X6  [JTP1138X6]

### Nets
!MCLR: K1.18(!MCLR) R2.1
+2V5: C4.1 K1.19(RA0)
+2V8..3V3: C2.1 C3.1 C5.1 C6.1 K1.17(AVDD) K1.28(VDD1) K1.40(VDD2) R1.2
GND: C1.2 C2.2 C3.2 C4.2 C5.2 C6.2 C7.2 C8.2 C9.2 K1.6(VSS1) K1.16(AVSS) K1.20(RA1) K1.29(VSS2) K1.39(VSS3) S1.1(P) S1.2(P1)
N$2: C1.1 K1.7(VCAP)
N$10: C7.1 R1.1 R2.2 S1.3(S) S1.4(S1)
RA2_OSC1: C8.1 K1.30(RA2) Q1.P$1
RA3_OSC2: C9.1 K1.31(RA3) Q1.P$2
RA4_PWM: K1.34(RA4)
RA7_GPIO: K1.13(RA7)
RA8_GPIO: K1.32(RA8)
RA9_GPIO: K1.35(RA9)
RA10_GPIO: K1.12(RA10)
RB0_ADC2: K1.21(RB0)
RB1_ADC3: K1.22(RB1)
RB2_ADC4: K1.23(RB2)
RB3_ADC5: K1.24(RB3)
RB4_GPIO: K1.33(RB4)
RB5_PGED3: K1.41(RB5)
RB6_PGEC3: K1.42(RB6)
RB7_INT0: K1.43(RB7)
RB8_I²C1_SCL: K1.44(RB8)
RB9_I²C1_SDA: K1.1(RB9)
RB10_GPIO: K1.8(RB10)
RB11_SPI1_SDI: K1.9(RB11)
RB12_GPIO: K1.10(RB12)
RB13_UART1_RX: K1.11(RB13)
RB14_SPI1_CLK: K1.14(RB14)
RB15_UART1_TX: K1.15(RB15)
RC0_ADC6: K1.25(RC0)
RC1_GPIO: K1.26(RC1)
RC2_GPIO: K1.27(RC2)
RC3_PWM: K1.36(RC3)
RC4_GPI_5V: K1.37(RC4)
RC5_PWM_5V_OD: K1.38(RC5)
RC6_GPO_5V_OD: K1.2(RC6)
RC7_GPO_5V_OD: K1.3(RC7)
RC8_SPI1_SDO: K1.4(RC8)
RC9_GPIO: K1.5(RC9)

### Notes on the sheet
- VREF+
- VREF-

### Library data of the parts
C1-C9 = rcl:C-EU: CAPACITOR, European symbol
K1 = Development_Board:PIC32MX150F128D
Q1 = Development_Board:ABM3: MINIATURE CERAMIC SMD CRYSTAL FEATURES: APPLICATIONS:  AT-cut fundamental or 3rd OT mode  Suitable for RoHS reflow profile  Tight Stability available ±10  Ceramic package hermetically glass sealed assures high precision and reliability.; EES_ID: 00000616; MANUFACTOR: Abracon; MPN: ABM3; OC_FARNELL: 2101329
R1 R2 = rcl:R-EU_: RESISTOR, European symbol
S1 = Development_Board:JTP1138X6

## Module VOLTAGE_SENSOR
Ports: +2V8..3V3(pwr) GND(pwr) U_SENS+(in) U_SENS-(in) U_U_MEAS(out) !U_SENS_EN(in)
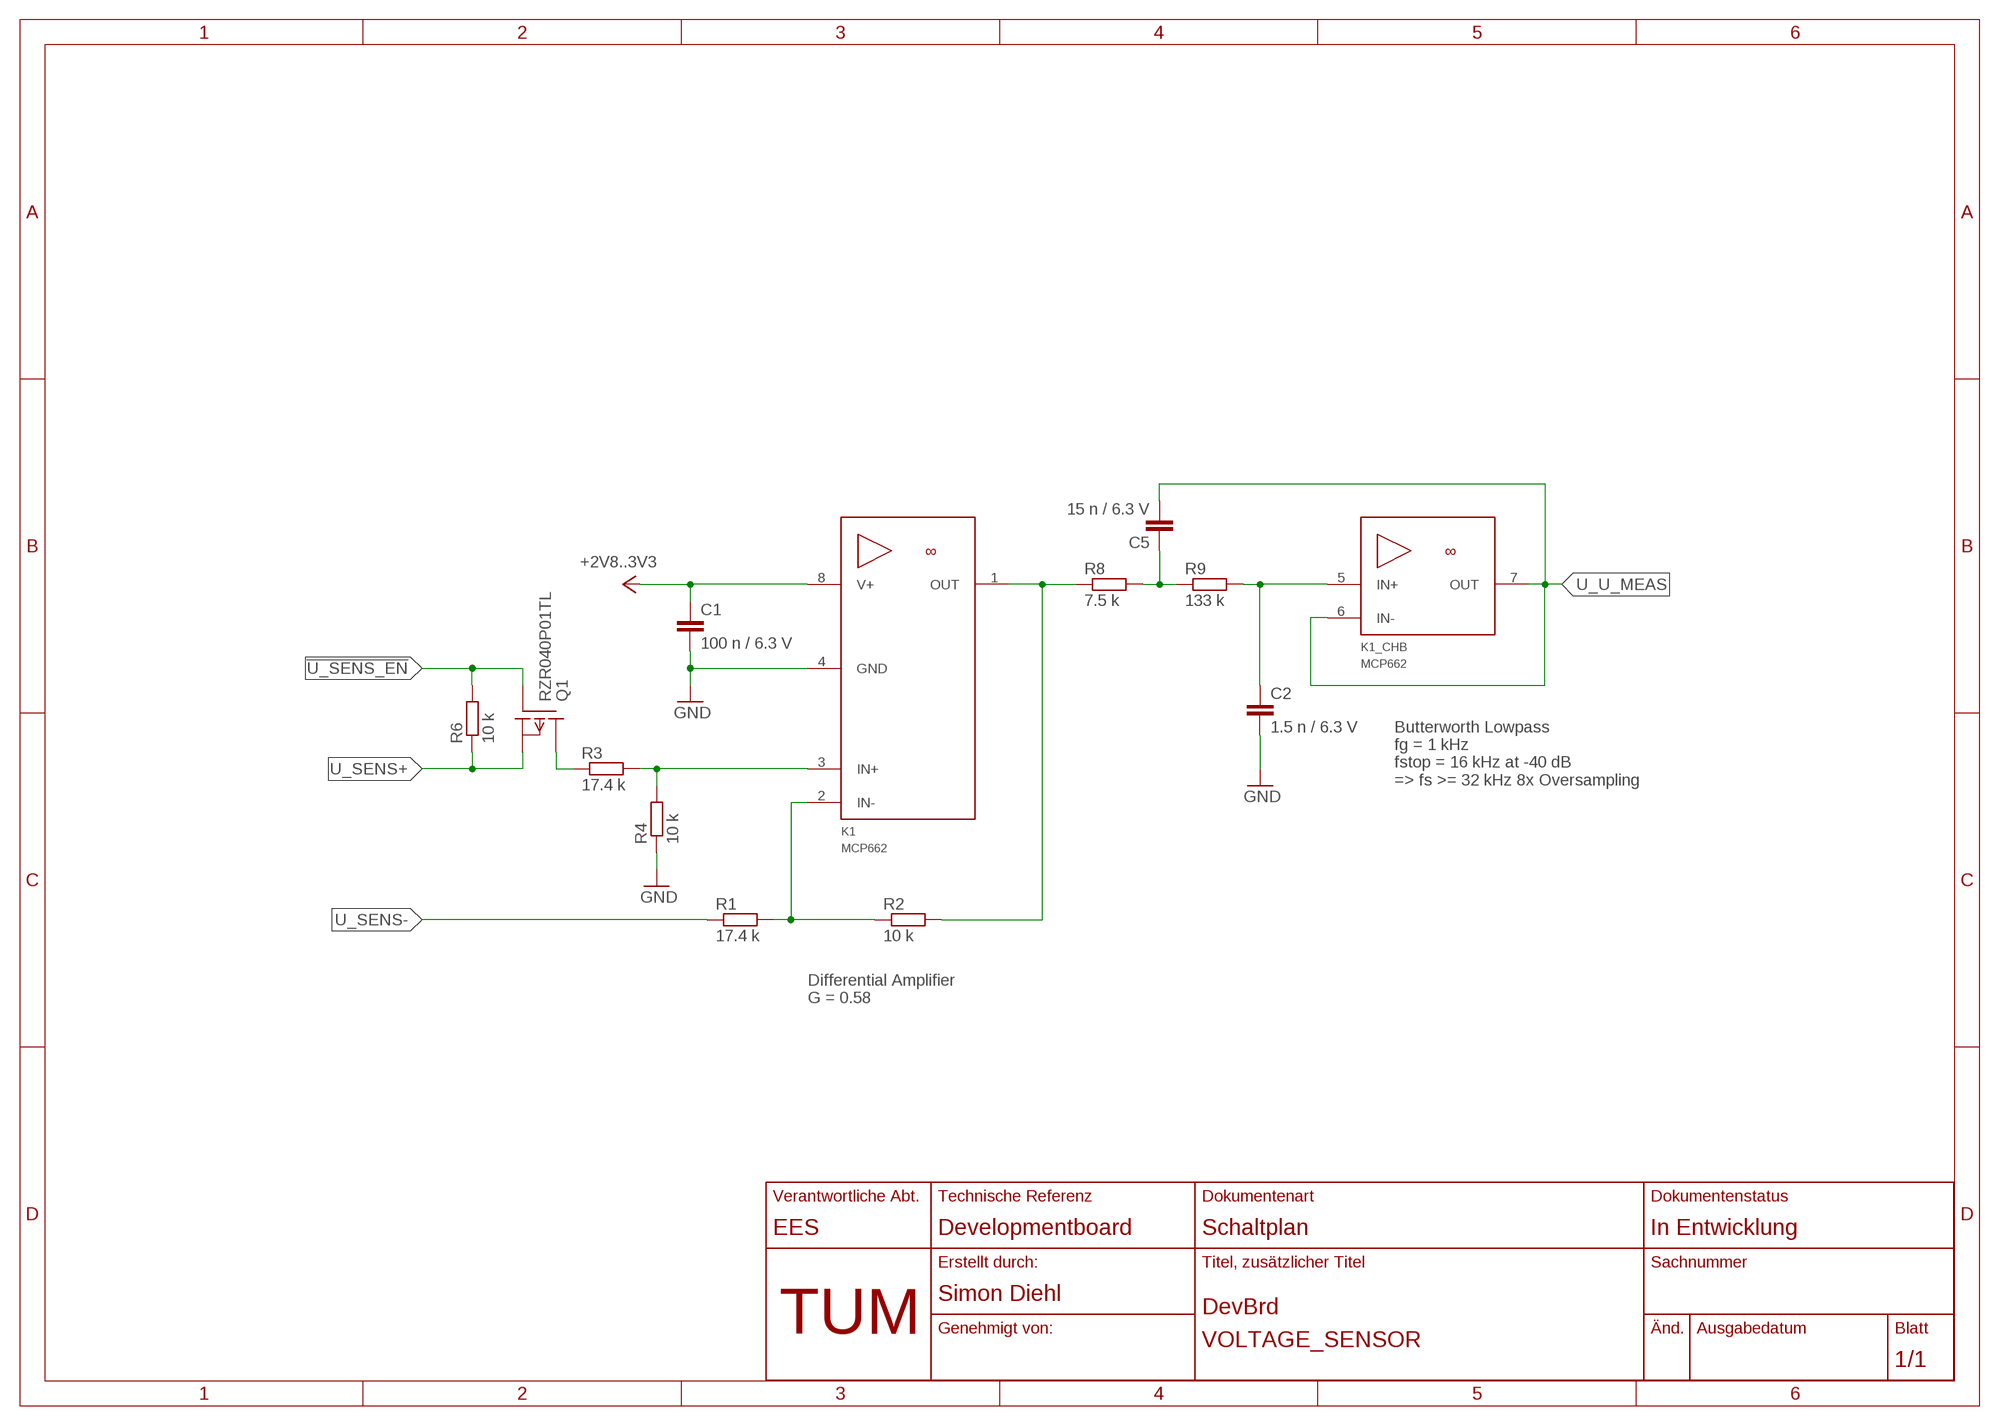
[diagram p9: schematic, module VOLTAGE_SENSOR, sheet 1]

### Parts
C1  100 n / 6.3 V  C-EUC0603  [C0603]
C2  1.5 n / 6.3 V  C-EUC0603  [C0603]
C5  15 n / 6.3 V  C-EUC0603  [C0603]
K1  MCP662  [SO-8]
Q1  RZR040P01TL  [SOT-23-3]
R1  17.4 k  R-EU_R0603  [R0603]
R2  10 k  R-EU_R0603  [R0603]
R3  17.4 k  R-EU_R0603  [R0603]
R4  10 k  R-EU_R0603  [R0603]
R6  10 k  R-EU_R0603  [R0603]
R8  7.5 k  R-EU_R0603  [R0603]
R9  133 k  R-EU_R0603  [R0603]

### Nets
!U_SENS_EN: Q1.1(G) R6.2
+2V8..3V3: C1.1 K1.8(V+)
GND: C1.2 C2.2 K1.4(GND) R4.1
N$1: Q1.3(D) R3.1
N$2: K1.3(IN+) R3.2 R4.2
N$3: K1.1(OUT) R2.2 R8.1
N$5: K1.2(IN-) R1.2 R2.1
N$6: C5.1 R8.2 R9.1
N$9: C2.1 K1.5(IN+) R9.2
U_SENS+: Q1.2(S) R6.1
U_SENS-: R1.1
U_U_MEAS: C5.2 K1.6(IN-) K1.7(OUT)

### Notes on the sheet
- Butterworth Lowpass
  fg = 1 kHz
  fstop = 16 kHz at -40 dB
  => fs >= 32 kHz 8x Oversampling
- Differential Amplifier
  G = 0.58

### Library data of the parts
C1 C2 C5 = rcl:C-EU: CAPACITOR, European symbol
K1 = Development_Board:MCP66*
Q1 = Development_Board:RZR040P01TL
R1-R4 R6 R8 R9 = rcl:R-EU_: RESISTOR, European symbol

## Board
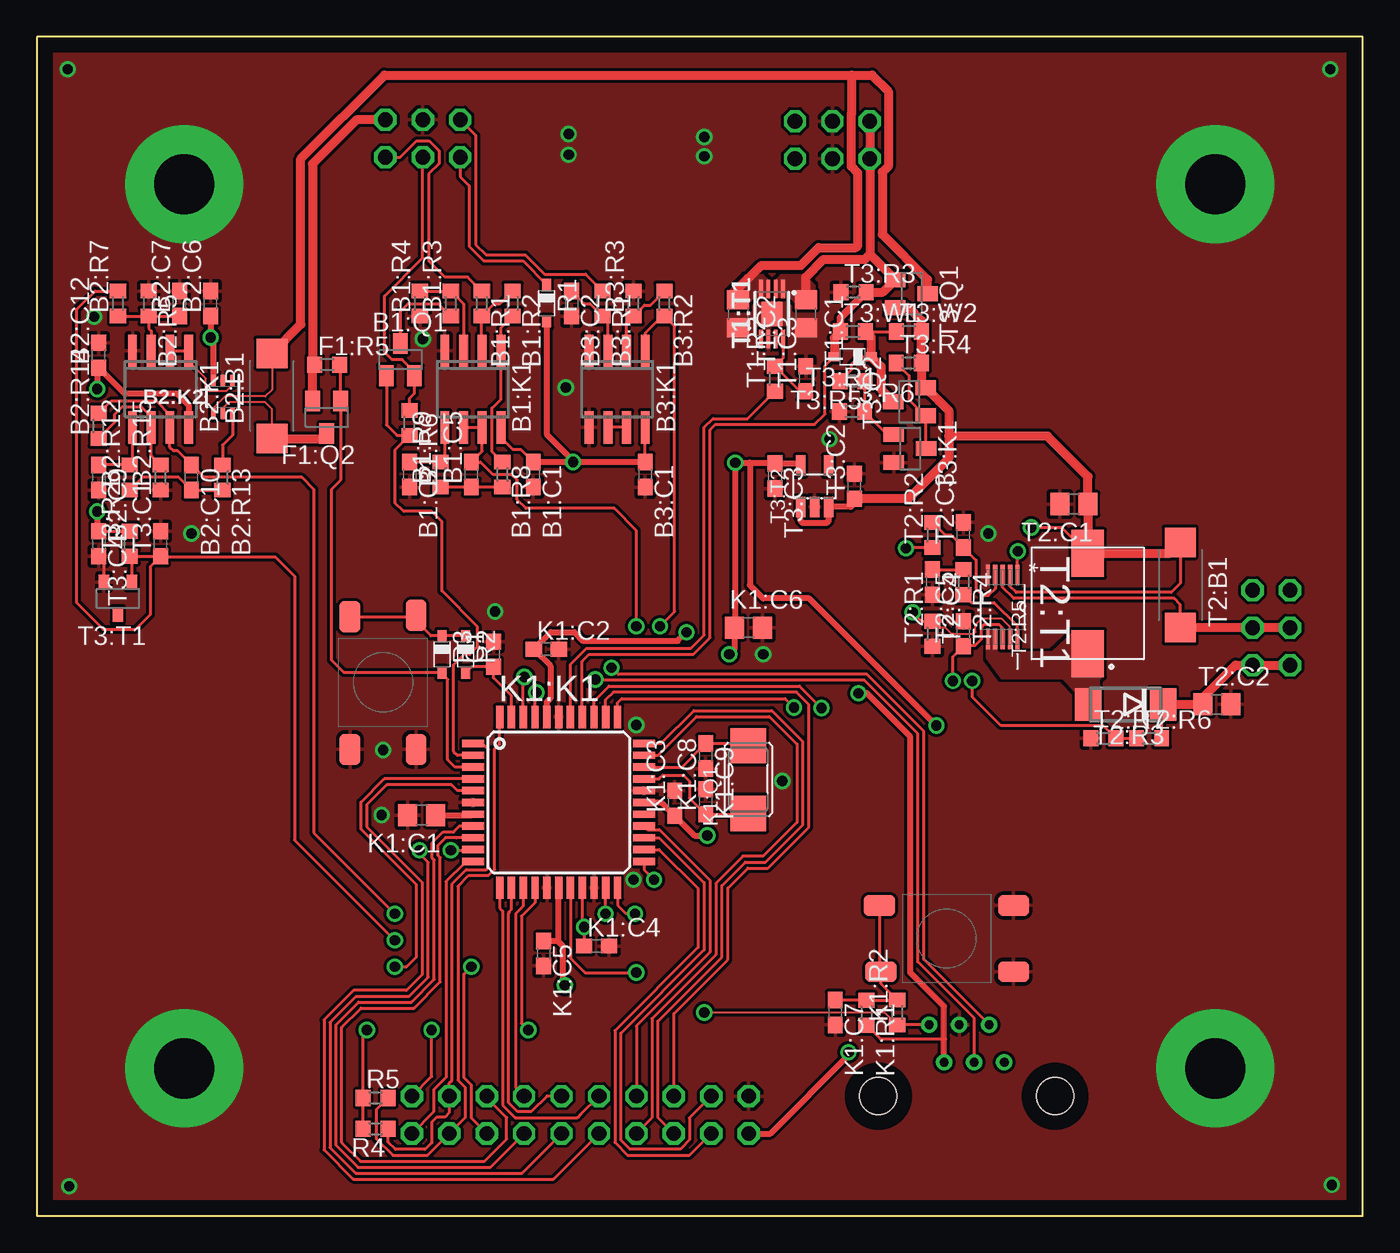
[diagram p10: board, top side]
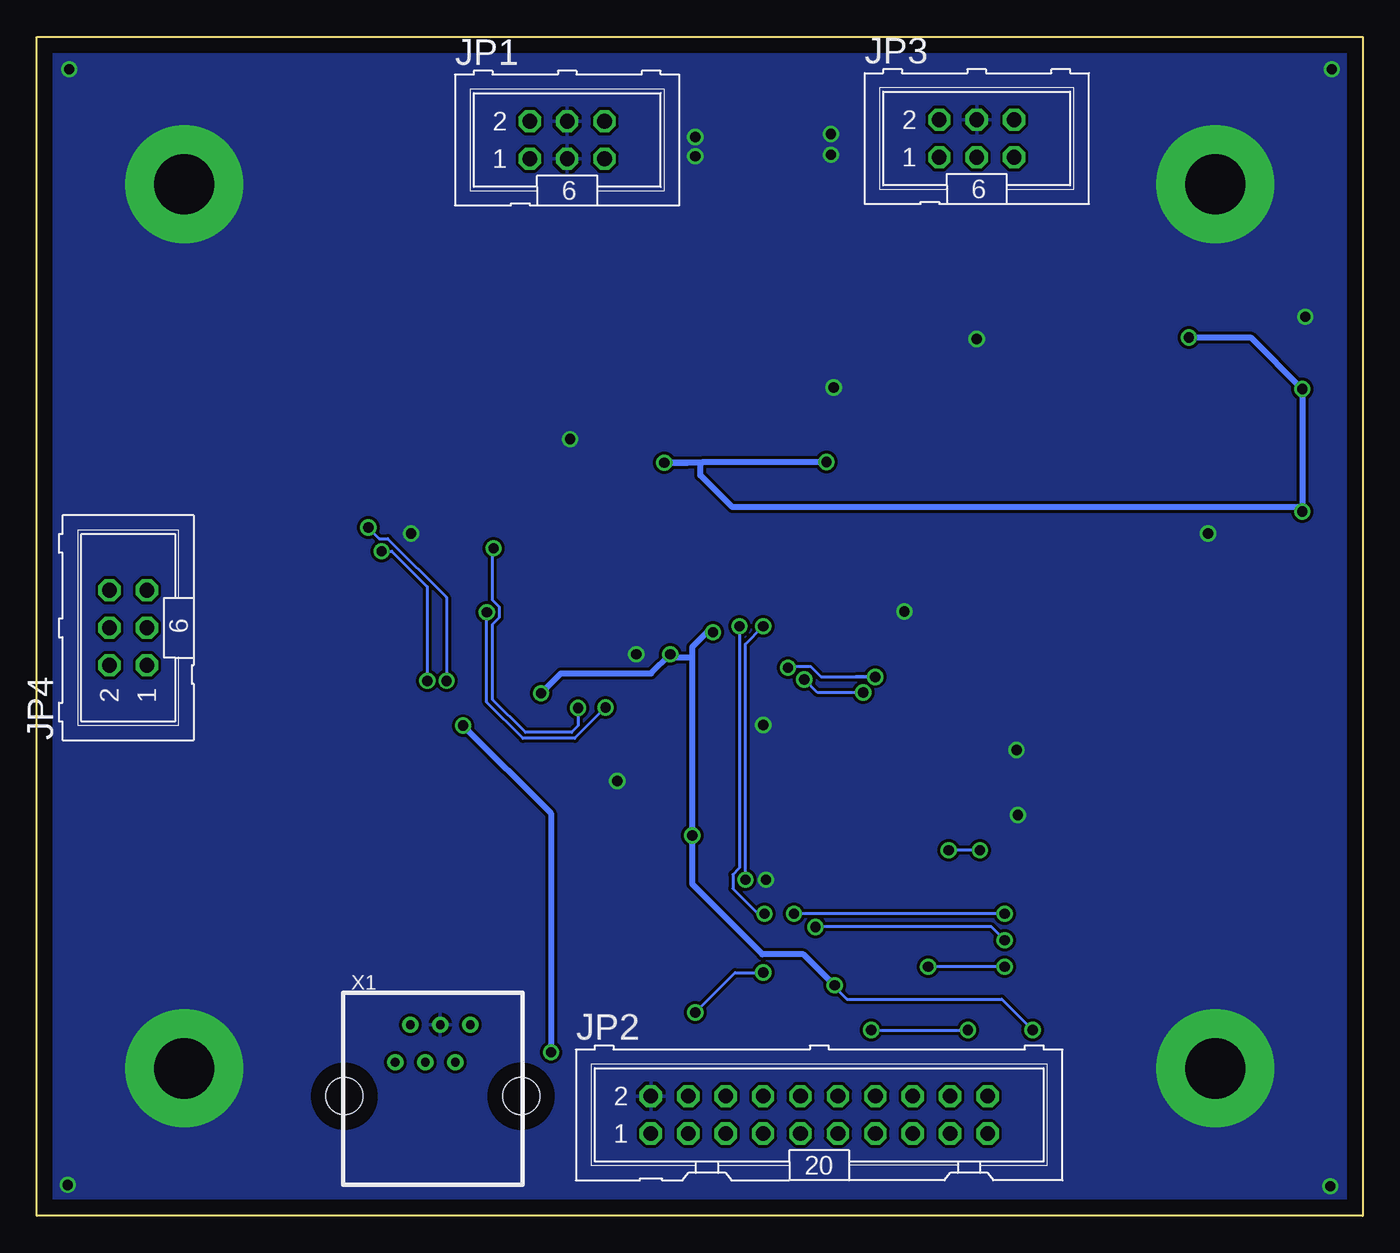
[diagram p11: board, bottom side, seen from below]

Size 90 x 80 mm. Coordinates in mm from the lower left corner, seen from the top.
Outline: 0,0 90,0 90,80 0,80 0,0
Copper layers (1*16): Top 0.035mm / dielectric 1.5mm / Bottom 0.035mm
Design rules "DesignRuleCheck EES *": minimum track width 4mil, minimum drill 0.7mm, track to track 8mil, track to pad 8mil, pad to pad 8mil, via to via 8mil, smd to smd 8mil, copper to edge 40mil, drill to drill 8mil, minimum pad ring 10mil, minimum via ring 8mil, stop-mask expansion 4mil, vias tented up to drill 0.85mm, thermal gap 10mil

### Footprints (pad centres in the part's own frame; a part is rotated, then mirrored left to right if it is on the bottom)
C0603 = smd 1.1 x 1: 1 -0.85,0; 2 0.85,0
SO-8 = smd 0.6 x 2.2: 1 -1.905,-2.6; 2 -0.635,-2.6; 3 0.635,-2.6; 4 1.905,-2.6; 5 1.905,2.6; 6 0.635,2.6; 7 -0.635,2.6; 8 -1.905,2.6
SOT-23-3 = smd 1 x 1.4: 1 -0.95,-1.1; 2 0.95,-1.1; 3 0,1.1
R0603 = smd 1 x 1.1: 1 -0.85,0; 2 0.85,0
R2512W = smd 2 x 2.1: 1 -2.896,0; 2 2.896,0
SC70-6 = smd 0.35 x 0.85: 1 -0.65,-1.1; 2 0,-1.1; 3 0.65,-1.1; 4 0.65,1.1; 5 0,1.1; 6 -0.65,1.1
ML6 = drill 1 octagon: 1 -2.54,-1.27; 2 -2.54,1.27; 3 0,-1.27; 4 0,1.27; 5 2.54,-1.27; 6 2.54,1.27
ML20 = drill 1 octagon: 1 -11.43,-1.27; 2 -11.43,1.27; 3 -8.89,-1.27; 4 -8.89,1.27; 5 -6.35,-1.27; 6 -6.35,1.27; 7 -3.81,-1.27; 8 -3.81,1.27; 9 -1.27,-1.27; 10 -1.27,1.27; 11 1.27,-1.27; 12 1.27,1.27; 13 3.81,-1.27; 14 3.81,1.27; 15 6.35,-1.27; 16 6.35,1.27; 17 8.89,-1.27; 18 8.89,1.27; 19 11.43,-1.27; 20 11.43,1.27
C0805 = smd 1.3 x 1.5: 1 -0.95,0; 2 0.95,0
TQFP-44 = smd 1.5 x 0.5: 1 -5.8,4; 2 -5.8,3.2; 3 -5.8,2.4; 4 -5.8,1.6; 5 -5.8,0.8; 6 -5.8,0; 7 -5.8,-0.8; 8 -5.8,-1.6; 9 -5.8,-2.4; 10 -5.8,-3.2; 11 -5.8,-4; 23 5.8,-4; 24 5.8,-3.2; 25 5.8,-2.4; 26 5.8,-1.6; 27 5.8,-0.8; 28 5.8,0; 29 5.8,0.8; 30 5.8,1.6; 31 5.8,2.4; 32 5.8,3.2; 33 5.8,4 | smd 0.5 x 1.5: 12 -4,-5.8; 13 -3.2,-5.8; 14 -2.4,-5.8; 15 -1.6,-5.8; 16 -0.8,-5.8; 17 0,-5.8; 18 0.8,-5.8; 19 1.6,-5.8; 20 2.4,-5.8; 21 3.2,-5.8; 22 4,-5.8; 34 4,5.8; 35 3.2,5.8; 36 2.4,5.8; 37 1.6,5.8; 38 0.8,5.8; 39 0,5.8; 40 -0.8,5.8; 41 -1.6,5.8; 42 -2.4,5.8; 43 -3.2,5.8; 44 -4,5.8
ABM3 = smd 2.4 x 2.4: P$1 -2.3,0; P$2 2.3,0
JTP1138X6 = smd 2.1 x 1.4: 1 4.55,-2.25; 2 4.55,2.25; 3 -4.55,2.25; 4 -4.45,-2.25
SOD323 = smd 0.8 x 0.6: A 1.25,0; C -1.25,0
MCP73831_DFN = smd 0.25 x 1.25: 1 -0.75,-1.7; 2 -0.25,-1.7; 3 0.25,-1.7; 4 0.75,-1.7; 5 0.75,1.7; 6 0.25,1.7; 7 -0.25,1.7; 8 -0.75,1.7 | smd 1.45 x 1.65: 9 0,0
DO214AA = smd 1.8 x 2.2: A 2.55,0; C -2.55,0
MCSDRH73B = smd 3.2 x 2.2: P$1 -3.4,0; P$2 3.4,0
SOP50P490X110-10N = smd 1.397 x 0.279: 1 -2.184,0.991; 2 -2.184,0.508; 3 -2.184,0; 4 -2.184,-0.508; 5 -2.184,-0.991; 6 2.184,-0.991; 7 2.184,-0.508; 8 2.184,0; 9 2.184,0.508; 10 2.184,0.991
DBZ_R-PDSO-G3 = smd 0.7 x 1: 1 -0.95,-1.1; 2 0.95,-1.1; 3 0,1.1
SOT-23-5L = smd 0.65 x 1.4: 1 -0.95,-1.4; 2 0,-1.4; 3 0.95,-1.4; 4 0.95,1.4; 5 -0.95,1.4
XRJK-S-01-6-6-0-2G2-NO = drill 0.6 pad 1.016: 1 -2.55,2.3; 2 -1.53,4.84; 3 -0.51,2.3; 4 0.51,4.84; 5 1.53,2.3; 6 2.55,4.84 | hole 2.5: -6,0; 6,0

### Placement (x,y rotation side)
B1:C1  100 n / 6.3 V  [C0603]  33.7,50.3 270 top
B1:C2  1.5 n / 6.3 V  [C0603]  25.3,50.3 270 top
B1:C5  15 n / 6.3 V  [C0603]  29.5,50.3 90 top
B1:K1  MCP662  [SO-8]  29.6,56.1 180 top
B1:Q1  RZR040P01TL  [SOT-23-3]  24.68,58.1 0 top
B1:R1  17.4 k  [R0603]  30.2,61.9 270 top
B1:R2  10 k  [R0603]  32.3,61.9 270 top
B1:R3  17.4 k  [R0603]  28.1,61.9 90 top
B1:R4  10 k  [R0603]  26,61.9 90 top
B1:R6  10 k  [R0603]  25.3,53.8 270 top
B1:R8  7.5 k  [R0603]  31.6,50.3 270 top
B1:R9  133 k  [R0603]  27.4,50.3 90 top
B2:B1  5 m  [R2512W]  15.96,55.63 90 top
B2:C6  100 n / 6.3 V  [C0603]  11.8,61.9 90 top
B2:C7  1 µ / 6.3 V  [C0603]  9.7,61.9 90 top
B2:C9  1.5 n / 6.3 V  [C0603]  4.2,50.1 270 top
B2:C10  15 n / 6.3 V  [C0603]  10.5,50.1 270 top
B2:C12  100 n / 6.3 V  [C0603]  4.2,58.4 90 top
B2:K1  MCP662  [SO-8]  8.4,56.1 180 top
B2:K2  INA210  [SC70-6]  12.63,55.57 180 top
B2:R5  2.94 k  [R0603]  7.6,61.9 270 top
B2:R7  9.31 k  [R0603]  5.5,61.9 90 top
B2:R12  143 k  [R0603]  6.3,50.1 90 top
B2:R13  6.81 k  [R0603]  12.6,50.1 270 top
B2:R14  3.92 k  [R0603]  4.2,53.6 90 top
B2:R15  28 k  [R0603]  8.4,50.1 90 top
B3:C1  100 n / 6.3 V  [C0603]  41.3,50.3 270 top
B3:C2  150 n / 6.3 V  [C0603]  36.3,61.9 270 top
B3:K1  MCP662  [SO-8]  39.4,56.1 180 top
B3:R1  100 k  [R0603]  38.4,61.9 270 top
B3:R2  56.2 k  [R0603]  42.6,61.9 270 top
B3:R3  44.2 k  [R0603]  40.5,61.9 90 top
C1  31,38.1 90 top
F1:Q2  RZR040P01TL  [SOT-23-3]  19.67,54.18 180 top
F1:R5  10 k  [R0603]  19.71,57.75 0 top
JP1  54,73 0 bottom
JP2  36.89,6.85 0 bottom
JP3  26.2,73.1 0 bottom
JP4  83.8,39.9 90 bottom
K1:C1  10 µ / 6.3 V  [C0805]  26.12,27.19 180 top
K1:C2  100 n / 6.3 V  [C0603]  34.58,38.44 0 top
K1:C3  100 n / 6.3 V  [C0603]  43.3,28 90 top
K1:C4  100 n / 6.3 V  [C0603]  38,18.3 0 top
K1:C5  100 n / 6.3 V  [C0603]  34.4,17.8 270 top
K1:C6  4.7 µ / 6.3 V  [C0805]  48.31,39.91 0 top
K1:C7  100 n / 6.3 V  [C0603]  54.2,13.8 270 top
K1:C8  18 p / 6.3 V  [C0603]  45.4,28.1 90 top
K1:C9  18 p / 6.3 V  [C0603]  45.4,31.2 270 top
K1:K1  PIC32MX150F128D  [TQFP-44]  35.42,28.05 0 top
K1:Q1  [ABM3]  48.3,29.6 90 top
K1:R1  10 k  [R0603]  56.32,13.78 270 top
K1:R2  1 k  [R0603]  58.4,13.8 90 top
K1:S1  JTP1138X6  [JTP1138X6]  61.75,18.81 0 top
R1  34.61,61.93 270 top
R2  29.1,38.1 270 top
R3  27.5,38.1 270 top
R4  23,5.9 180 top
R5  23,8 0 top
S1  23.5,36.2 270 top
T1:C1  4.7 µ / 10 V  [C0805]  52.2,61.2 270 top
T1:C2  4.7 µ / 10 V  [C0805]  47.6,61.2 270 top
T1:C3  1 µ / 6.3 V  [C0603]  52.2,56.8 90 top
T1:R2  2 k  [R0603]  50.1,56.8 90 top
T1:T1  MCP73831DFN  [MCP73831_DFN]  49.9,61.2 180 top
T2:B1  50 m  [R2512W]  77.62,42.8 270 top
T2:C1  4.7 µ / 10 V  [C0805]  70.4,48.3 180 top
T2:C2  4.7 µ / 25 V  [C0805]  80.1,34.7 0 top
T2:C3  1 µ / 6.3 V  [C0603]  62.9,46.2 90 top
T2:C4  10 n / 6.3 V  [C0603]  60.8,43 270 top
T2:C5  10 n / 6.3 V  [C0603]  62.9,39.5 90 top
T2:R1  10 k  [R0603]  60.8,39.5 90 top
T2:R2  1 k  [R0603]  60.8,46.2 90 top
T2:R3  STPS1L30U  [DO214AA]  73.9,34.7 180 top
T2:R4  0  [R0603]  62.9,43 270 top
T2:R5  MCSDRH73B  [MCSDRH73B]  71.34,41.55 90 top
T2:R6  102 k  [R0603]  75.5,32.4 0 top
T2:R7  14.7 k  [R0603]  72.4,32.4 0 top
T2:T1  LT1618EMSPBF  [SOP50P490X110-10N]  65.56,41.31 270 top
T3:C1  1 µ / 6.3 V  [C0603]  8.4,45.6 90 top
T3:C2  1 µ / 10 V  [C0603]  55.5,49.5 90 top
T3:C3  1 µ / 6.3 V  [C0603]  50.1,50.2 270 top
T3:C4  1 µ / 6.3 V  [C0603]  4.2,45.6 270 top
T3:K1  IRLML6344TRPBF  [SOT-23-3]  59.27,52.06 270 top
T3:Q1  RZR040P01TL  [SOT-23-3]  59.37,62.56 270 top
T3:Q2  RZR040P01TL  [SOT-23-3]  59.23,55.24 90 top
T3:R1  BAT60  [SOD323]  55.38,58.3 180 top
T3:R2  300  [R0603]  6.3,45.6 90 top
T3:R3  10 k  [R0603]  55.44,62.67 0 top
T3:R4  2 k  [R0603]  59.19,57.87 0 top
T3:R5  3.64 k  [R0603]  55.36,56.63 180 top
T3:R6  1.3 k  [R0603]  55.34,54.57 0 top
T3:T1  LM4040A25IDBZT  [DBZ_R-PDSO-G3]  5.5,41.9 180 top
T3:T2  XC6210B332MR  [SOT-23-5L]  52.8,49.5 0 top
T3:W1  0  [R0603]  55.4,60 0 top
T3:W2  0  [R0603]  59.2,60 0 top
X1  63.12,8.12 0 bottom

### Tracks (layer width: path | path; a pad name or v marks a point on that pad's centre or on a via)
!BAT_CONNECT
  Top 0.2: F1:R5.2 20.62,57.69 F1:Q2.1 20.65,55.31 20.65,49.95 20,49.3 20,37.7 20.85,36.85 R3.A 27.5,36.8 27.9,36.4 27.9,30.95 28.4,30.45 K1:K1.3
!CH_CTRL
  Top 0.2: 36.2,33.87 K1:K1.38 36.22,37.42 37.3,38.5 44.4,38.5 45.3,39.4 45.3,53.5 45.9,54.1 48.25,54.1 T1:R2.1
!LED_SHDN  (via drill 0.7)
  Top 0.15: 66,39.19 66,40.01 65.48,40.53 64.14,40.53 63.72,40.12 63.72,39.62 63.6,39.5 62.2,39.5 62.09,39.5 61.64,39.95 61.2,39.95
  Top 0.2: K1:K1.34 39.42,34.82 39.7,35.1 50.79,35.1 v51.39,34.49 | T2:T1.9 66,39.19 | 61.42,40.35 T2:R1.2 | T2:R1.2 60.06,40.35 v59.46,40.95 | T2:R1.2 61.2,39.95
  Bottom 0.2: v51.39,34.49 53.49,32.4 57,32.4 59.46,34.86 v59.46,40.95
!MCLR  (via drill 0.7)
  Top 0.15: K1:R2.1 57.55,13.8 54.83,13.8 53.57,13.8 v45.3,13.8
  Top 0.2: X1.6 K1:R2.1 | K1:K1.18 36.22,17.48 37.2,16.5 v40.7,16.5
  Bottom 0.2: v45.3,13.8 42.6,16.5 v40.7,16.5
!U_SENS_EN
  Top 0.2: B1:Q1.1 23.73,53.67 24.45,52.95 B1:R6.2 24.3,51.95 24.3,48.4 24.9,47.8 26.8,47.8 27.5,47.1 27.5,42.4 29.9,40 29.9,38.6 29.4,38.1 29,38.1 28.3,37.4 28.3,31.5 28.55,31.25 K1:K1.2
+2V5  (via drill 0.7)
  Top 0.15: 8.2,44.55 T3:C1.1
  Top 0.2: K1:K1.19 37.02,19.73 v37.15,19.6 K1:C4.1 | T3:T1.1 6.45,44.6 T3:R2.1 T3:C1.1 | T3:C1.1 8.45,44.7 16.2,44.7 17.5,43.4 17.5,25.5 v24.3,18.7 | T3:C1.1 7.7,44.05 7.7,40.8 6.7,39.8 4.5,39.8 2.7,41.6 2.7,61.5 3.95,62.75 B2:R7.2
  Bottom 0.2: v24.3,18.7 25.2,19.6 v37.15,19.6
+2V8..3V3  (via drill 0.7)
  Top 0.2: 43.23,27.23 K1:C3.1 | B2:C12.1 4.1,57.45 | 4.1,46.55 T3:C4.1 T3:R2.2 | 36.5,51.15 v36.4,51.15 | B3:C1.1 B3:K1.8 | K1:R1.2 57.25,12 61.59,12 | B1:K1.8 31.5,52.8 32.3,52 32.85,52 B1:C1.1 | R4.2 R5.1 22.15,12.35 v22.4,12.6
  Top 0.4: v36.4,51.15 B1:C1.1 | 4.1,57.45 v4.1,56.1 | v4.1,47.8 4.1,46.55 | B3:C1.1 36.5,51.15 34.61,53.04 R1.A | B2:K1.8 10.3,54.99 9.49,55.81 5.94,55.81 B2:C12.1 4.2,57.51 | B2:K2.3 11.98,59.42 v11.8,59.6 B2:C6.1 | T3:T2.5 51.7,51.05 T3:C3.1 50.05,51.1 48.4,51.1 | K1:K1.40 34.62,34.87 34.86,35.1 34.86,37.31 K1:C2.1 34.89,39.6 36.49,39.6 37.09,39 37.09,39.01 43.51,39.01 v44.1,39.6 | K1:K1.28 42.4,28.05 43.23,27.23 | 48.4,51.1 v47.4,51.1 47.4,39.95 K1:C6.1 47.36,38.51 47,38.15 v47,38.1 | JP2.1 49.8,5.58 55.1,10.88 v55.1,11.1 | X1.5 61.59,12 61.59,14.21 59.3,16.5 59.3,32.5 56.34,35.46 v55.77,35.46 | 48.4,51.1 48.4,42.8 49.3,41.9 52.42,41.9 v61.06,33.26 | 35.42,18.6 K1:K1.17 | K1:C5.1 35.37,18.65 35.42,18.6 | 35.42,18.6 35.7,18.32 35.7,15.79 v35.84,15.64 | K1:C3.1 44.65,25.8 v45.5,25.8
  Bottom 0.2: 36.45,51.2 v36.4,51.15 | v47.4,51.1 47.35,51.15 | v35.84,15.64 35.84,15.54 35,14.7 24.5,14.7 v22.4,12.6
  Bottom 0.4: v11.8,59.6 7.6,59.6 v4.1,56.1 v4.1,47.8 4.4,48.1 42.8,48.1 44.95,50.25 44.95,51 44.8,51.15 | v36.4,51.15 44.8,51.15 | 47.35,51.15 44.8,51.15 | v47.4,51.1 45.8,51.1 | 45.5,37.9 v45.5,25.8 45.5,22.5 40.74,17.74 37.94,17.74 v35.84,15.64 | 45.5,37.9 45.5,38.6 44.5,39.6 v44.1,39.6 | 45.5,37.9 46.8,37.9 v47,38.1 48.3,36.8 54.43,36.8 v55.77,35.46 | v55.1,11.1 55.1,27.3 v61.06,33.26
+5V
  Top 0.2: T3:R1.A 53.5,57.67 53.5,54.4 52.8,53.7 46.07,53.7 45.7,53.33 45.7,39.23 44.57,38.1 37.5,38.1 37.02,37.62 K1:K1.37
  Top 0.5: T3:R3.2 54.55,60.93 T3:W1.1
  Top 0.6: JP1.2 JP1.1 56.54,65.24 | T3:W1.1 54.13,59.58 T3:R1.A | 56.54,65.24 T3:Q1.1 57.43,62.67 T3:R3.2 | T1:C1.1 52.2,63.7 53.4,64.9 56.2,64.9 56.54,65.24
  pour Top (no thermals): 50.2,63.5 50.2,62.4 51.1,62.4 51.6,61.9 51.6,61.6 52.8,61.6 52.8,63.1 52.1,63.8 50.5,63.8
ADC1
  Top 0.2: K1:K1.24 42.25,24.85 44.89,22.21 44.89,18.22 39.24,12.57 39.24,4.97 40.09,4.12 44.32,4.12 JP2.3
ADC2
  Top 0.2: 45.8,8.14 JP2.4 44.3,6.64 44.3,5.14 43.68,4.52 40.26,4.52 39.64,5.14 39.64,12.4 45.29,18.05 45.29,22.61 42.25,25.65 K1:K1.25
B1:N$1
  Top 0.2: B1:Q1.3 24.68,61.38 25.2,61.9 27.25,61.9 B1:R3.1
B1:N$2
  Top 0.2: B1:R4.2 B1:R3.2 28.96,61.88 B1:K1.3
B1:N$3
  Top 0.2: B1:R2.2 31.5,60.26 B1:K1.1 31.5,55.41 30.9,54.8 30.9,51.85 B1:R8.1
B1:N$5
  Top 0.2: B1:K1.2 30.2,58.73 B1:R1.2 31.05,61.9 31.45,61.9 B1:R2.1
B1:N$6
  Top 0.2: B1:R8.2 B1:C5.1 B1:R9.1
B1:N$9
  Top 0.2: B1:C2.1 25.4,51.15 B1:R9.2 27.48,51.23 27.7,51.45 B1:K1.5
B2:+0V6
  Top 0.15: 10.3,58 11.48,56.82 11.48,56.2 11.71,55.97 12.87,55.97 13.28,56.38
  Top 0.2: B2:K1.2 B2:K1.1 10.3,58.01 10.3,58 | 13.28,56.34 B2:K2.1 13.28,56.38
B2:N$1
  Top 0.2: B2:R5.2 7.6,60.2 7.76,60.03 B2:K1.3 | B2:R7.1 B2:R5.2 | B2:R5.2 B2:C7.1
B2:N$4
  Top 0.2: B2:R13.1 12.6,52.3 13.28,52.98 B2:K2.6
B2:N$12
  Top 0.2: B2:K1.5 6.5,51.15 B2:R12.2 B2:C9.1
B2:N$13
  Top 0.2: B2:R13.2 B2:C10.2 9.63,50.12 7.17,50.12 B2:R12.1
B2:N$14
  Top 0.2: B2:R14.1 5.3,53.85 5.3,54.4 5.8,54.9 7.1,54.9 7.8,54.2 7.76,54.16 B2:K1.6 7.76,51.59 B2:R15.2
B3:N$1
  Top 0.2: B3:K1.7 B3:K1.6
B3:N$2
  Top 0.2: B3:K1.3 38.77,60.69 B3:R1.2 37.55,61.9 37.15,61.9 B3:C2.1
B3:N$4
  Top 0.2: B3:K1.2 40.03,60.59 B3:R3.1 41.25,61.8 41.65,61.8 B3:R2.1
GND  (via drill 0.7, 4.1 pad 8)
  Top 0.2: T3:C4.2 4.55,44.4 T3:T1.2
  other vias: 80,10 10,10 10,70 80,70 40.5,22.8 87.9,2.1 2.2,2 2.1,77.8 87.8,77.8 23.5,31.6 23.4,27.2 50.6,29.5 40.7,33.3 45.3,73.2 45.3,71.9 36.1,73.4 36.1,72 10.5,46.3 49.3,38.1 31.1,41 53.8,52.7 35.9,56.2 26.2,59.5 3.9,61 64.6,46.3
  pour Bottom: 0,0 90,0 90,80 0,80
  pour Top (rank 6): 0,0 90,0 90,80 0,80
  pour Top (rank 2, no thermals): 46.4,63.6 53.1,63.6 53.1,58.8 46.4,58.8
  pour Top (no thermals): 63.7,46.2 63.7,42.5 65.6,42.5 65.6,45.1 64.5,46.2
GPIO1
  Top 0.2: K1:K1.33 42.38,32.05 44.6,34.27 49.9,34.27 52,32.17 52,26.53 49.47,24 48.1,24 46.5,22.4 46.5,19.6 46.5,17.55 42.16,13.21 42.16,6.66 JP2.5
GPIO2
  Top 0.2: JP2.6 43.24,13.72 46.9,17.38 46.9,22.23 48.27,23.59 49.63,23.59 52.41,26.37 52.41,34.69 51.57,35.53 39.13,35.53 38.62,35.02 K1:K1.35
GPIO3
  Top 0.2: K1:K1.32 42.15,31.25 44.77,33.87 49.73,33.87 51.6,32 51.6,26.7 49.3,24.4 47.93,24.4 46.1,22.56 46.1,17.72 41.76,13.38 41.76,6.64 JP2.7
GPIO4
  Top 0.2: K1:K1.26 41.47,26.2 42.27,26.2 45.69,22.78 45.69,17.88 40.7,12.89 JP2.8
GPIO5
  Top 0.2: K1:K1.5 28.55,28.85 28.15,29.25 23.75,29.25 22.4,27.9 22.4,26.4 26.17,22.63 26.17,16.37 25.1,15.3 21.5,15.3 19.49,13.29 19.49,4.47 21.48,2.48 35.06,2.48 JP2.9
GPIO6
  Top 0.2: JP2.10 36.92,6.88 36.74,6.7 36.7,6.66 32.48,6.66 31.62,7.51 31.62,20.68 31.42,20.88 K1:K1.12
GPIO7  (via drill 0.7)
  Top 0.2: K1:K1.10 29.57,24.8 v28.1,24.8 | v25.98,24.8 25.98,24.56 26.57,23.98 26.57,16.2 25.27,14.9 21.67,14.9 19.9,13.13 19.9,4.63 21.64,2.89 32.93,2.89 JP2.11
  Bottom 0.2: v25.98,24.8 v28.1,24.8
GPIO8
  Top 0.2: K1:K1.13 32.22,20.79 32.12,20.68 32.07,20.64 32.07,20.57 32.02,20.53 32.02,7.68 32.64,7.06 33.56,7.06 34.62,8.12 JP2.12
GPIO9
  Top 0.2: K1:K1.8 28.69,26.45 28.3,26.06 27.58,26.06 26.84,25.32 26.84,24.28 26.97,24.14 26.97,16.03 25.43,14.49 21.83,14.49 20.3,12.96 20.3,4.8 21.6,3.5 21.74,3.36 21.81,3.29 30.79,3.29 JP2.13
I_BAT_FORCE+
  Top 0.2: F1:R5.1 18.81,57.7 18.72,57.7
  Top 0.6: F1:Q2.2 18.72,57.7 18.72,71.38 21.71,74.37 JP3.6
K1:N$2
  Top 0.2: 29.56,27.19 K1:K1.7
  Top 0.4: K1:C1.1 29.56,27.19
K1:N$10
  Top 0.2: K1:C7.1 54.22,14.63 K1:R1.1 58.38,14.63 K1:R2.2 57.3,15.75 K1:S1.4 57.2,16.66 57.2,16.8 K1:S1.3
K1:RA2_OSC1
  Top 0.2: K1:Q1.P$1 48.25,27.25 K1:C8.1 44.3,28.35 44.3,29.5 43.9,29.9 42.5,29.9 42.25,29.65 K1:K1.30
K1:RA3_OSC2
  Top 0.2: K1:Q1.P$2 48.15,32.05 K1:C9.1 43.8,30.45 K1:K1.31
LED_IADJ  (via drill 0.7)
  Top 0.2: K1:K1.36 37.82,34.92 38.84,35.94 51.78,35.94 v53.26,34.46 | v59,45.3 59.05,45.35 T2:R2.1
  Bottom 0.2: v59,45.3 59.05,45.25 59.05,41.76 58.6,41.31 58.6,40.6 59.05,40.15 59.05,35.02 56.83,32.8 53.7,32.8 53.26,33.24 v53.26,34.46
N$1
  Top 0.15: B2:B1.1 15.96,54.74 15.5,55.2 13.03,55.2 12.63,54.8
  Top 0.2: 12.63,54.8 B2:K2.5
  Top 0.6: B2:B1.1 19.32,52.73 F1:Q2.3
N$2
  Top 0.15: B2:B1.2 15.96,56.06 15.5,55.6 12.79,55.6 11.98,54.8
  Top 0.2: T1:T1.4 49.12,62.88 | 48.3,62.05 47.7,62.05 T1:C2.1 | T1:T1.3 49.6,62.9 | 11.98,54.8 B2:K2.4
  Top 0.6: 55.3,77.4 23.6,77.4 17.92,71.72 17.92,60.48 B2:B1.2 | 55.3,77.4 56.7,77.4 57.8,76.3 57.8,71.21 57.4,70.81 57.4,66.6 60.47,63.53 T3:Q1.3 | 55.3,77.4 55.3,74.81 55.28,74.79 55.28,71.21 55.74,70.75 55.74,65.84 55.6,65.7 53.07,65.7 51.86,64.5 49.2,64.5 47.6,62.9 T1:C2.1
  pour Top (no thermals): 47,61.6 48.2,61.9 48.7,62.4 49.7,62.4 49.7,63.4 49.3,63.8 48.1,63.8 47,62.7
N$3
  Top 0.2: K1:K1.43 32.22,35.28 31,36.5 C1.1 29.5,37.25 R2.A
N$4
  Top 0.2: R2.C R3.C 26.75,39.35 25.65,40.45 25.65,40.65 | S1.4 25.65,40.65 | 25.65,40.65 S1.3
PGC  (via drill 0.7)
  Top 0.2: v33.09,36.57 33.02,36.5 K1:K1.42 | X1.2 60.21,17.4 60.21,32.89 56.36,36.74 39.46,36.74 v39.01,37.19
  Bottom 0.2: 34.42,36.57 v33.09,36.57 36.77,36.57 37.46,37.26 38.95,37.26 v39.01,37.19
PGD  (via drill 0.7)
  Top 0.2: v33.9,35.5 33.82,35.42 K1:K1.41 | X1.3 63.63,13.41 59.8,17.24 59.8,32.73 56.19,36.34 37.96,36.34 v37.9,36.4
  Bottom 0.2: v33.9,35.5 37,35.5 v37.9,36.4
SCK1
  Top 0.2: K1:K1.14 33.02,21.02 32.5,20.5 32.5,8.7 JP2.14
SCL1
  Top 0.2: K1:K1.44 31.42,32.02 31.08,31.68 31.08,23.51 30.66,23.09 29.32,23.09 28.59,22.36 28.59,9.21 29.08,8.72 29.08,6.66 JP2.17 26.52,4.1 24.17,4.1 23.05,5.22 23.05,7.2 R5.2
SDA1
  Top 0.2: K1:K1.1 30.15,32.05 30.2,32.1 30.67,31.63 30.67,23.67 30.5,23.5 29.16,23.5 28.18,22.53 28.18,9.17 28,8.98 JP2.18 | 28,7.55 JP2.18 | JP2.18 28,7 27.7,6.7 27.15,6.7 26.8,6.35 26.8,4.95 26.35,4.5 24.34,4.5 23.85,4.99 R4.1
SDI1
  Top 0.2: K1:K1.9 28.46,25.65 28.45,25.66 27.75,25.66 27.24,25.16 27.24,24.45 27.38,24.31 27.38,15.87 25.6,14.09 22,14.09 20.7,12.79 20.7,4.97 21.98,3.69 30.39,3.69 31.9,5.2 31.9,6.66 30.54,8.02 JP2.16
SDO1  (via drill 0.7)
  Top 0.2: K1:K1.4 23.58,29.65 22,28.07 22,26.23 25.77,22.46 25.77,17.57 25.1,16.9 v24.3,16.9 | JP2.15 29.48,6.64 29.48,8.89 28.99,9.38 28.99,16.39 v29.5,16.9
  Bottom 0.2: v24.3,16.9 v29.5,16.9
T1:N$2
  Top 0.2: T1:C3.1 51.8,55.95 T1:R2.2 50.65,58.2 T1:T1.8
T2:N$1
  Top 0.2: T2:T1.4 65.05,42.55 64.6,42.1 64.2,42.1 63.75,42.55 63.75,44.5 T2:C3.1 62.05,46.2 61.65,46.2 T2:R2.2
T2:N$2
  Top 0.2: T2:T1.10 66.51,39.16 66.51,40.07 64.98,41.61 63.44,41.61 T2:R4.2
T2:N$3
  Top 0.2: T2:C4.1 T2:R4.1
T2:N$6  (via drill 0.7)
  Top 0.2: T2:R6.1 T2:R7.2 72.4,33.25 65.45,33.25 63.5,35.2 v63.5,36.3 | T2:T1.1 66.55,45.05 v66.6,45.1
  Bottom 0.2: v63.5,36.3 63.5,42.7 65.9,45.1 v66.6,45.1
T2:SW
  pour Top (no thermals): 64.5,39.8 64.5,37.9 65.5,36.5 69.6,36.5 70.6,35.5 70.6,33.8 72.1,33.8 72.1,36.4 72.3,36.6 72.3,39.6 70.4,39.6 68.9,38.2 65.7,38.2 65.2,38.4 65.2,39.7 65.1,39.8
T3:N$1
  Top 0.2: 58.25,59.9 T3:W2.1 T3:W1.2 | T3:R5.2 55.3,57.42 55.3,57.8 55.8,58.3 T3:R1.C
  Top 0.6: T3:W1.2 56.63,59.62 T3:R1.C 57.3,57.63 57.3,56.07 T3:Q2.3
T3:N$2
  Top 0.2: T3:R4.1 59.2,57.01 59.2,55.37 60.37,54.2 60.37,54.25 T3:Q2.1 60.33,52.1 T3:K1.3
T3:N$3
  Top 0.2: T3:K1.1 57.75,53.01 T3:R6.2 56.19,56.61 T3:R5.1
U1RX
  Top 0.2: JP2.19 26.94,7.06 26.94,8.56 27.78,9.4 27.78,22.69 28.99,23.9 | 28.99,23.9 29.47,23.9 | K1:K1.11 29.14,24.05 28.99,23.9
U1TX  (via drill 0.7)
  Top 0.2: K1:K1.15 33.82,21.25 32.9,20.33 32.9,13.05 v33.36,12.6 | JP2.20 26.8,9.46 v26.8,12.6
  Bottom 0.2: v33.36,12.6 v26.8,12.6
U_I_MEAS  (via drill 0.7)
  Top 0.2: B2:R14.2 5.05,55.3 5.63,55.3 5.64,55.31 8.09,55.31 9.04,54.37 B2:K1.7 9.04,52.16 9.3,51.9 9.55,51.9 B2:C10.1 11.35,50.1 18,50.1 18.8,49.3 18.8,26 v24.3,20.5 | v38.6,20.5 38.6,22.23 K1:K1.21
  Bottom 0.2: v24.3,20.5 v38.6,20.5
U_T_MEAS  (via drill 0.7)
  Top 0.2: v40.6,20.5 40,20.5 39.42,21.08 K1:K1.22 | B3:K1.1 41.3,59.91 42.45,61.05 B3:R2.2 43.3,60.35 43.3,41 v42.3,40
  Bottom 0.2: v40.6,20.5 41.06,20.5 42.76,22.2 42.76,23.16 42.3,23.61 42.3,39.5 42.3,39.51 v42.3,40
U_U_MEAS  (via drill 0.7)
  Top 0.2: v41.9,22.8 41.22,23.48 K1:K1.23 | B1:K1.6 B1:K1.7 30.23,51.88 B1:C5.2 30.12,51.15 30.97,50.3 32.23,50.3 32.6,49.93 32.6,48.6 33.2,48 39.2,48 40.7,46.5 v40.7,40
  Bottom 0.2: v40.7,40 41.9,38.8 v41.9,22.8
V+  (via drill 0.7)
  Top 0.102: T3:Q2.2 60.46,56.19
  Top 0.15: T3:Q1.2 58.33,61.61 | 55.5,48.35 T3:C2.1
  Top 0.2: 60.04,59.9 T3:W2.2 | 60.04,56.48 T3:Q2.2 | T2:T1.8 65.52,39.16 65.52,39.92 65.32,40.13 64.3,40.13 64.13,39.95 64.13,39.13 63.7,38.7 62.95,38.7 T2:C5.1 62.19,37.94 v62.19,36.3 | T2:T1.2 66.07,42.71 66.48,42.3 77,42.3 77.62,42.92 77.62,45 T2:B1.1 77.46,45.54 | 71.4,44.95 T2:R5.P$2 69.59,46.7 v67.5,46.7 | 71.4,44.95 71.5,44.95 | 71.35,45 71.4,44.95
  Top 0.4: 55.5,48.35 55.25,48.1 T3:T2.3 53.75,47.15 53.6,47 52,47 51.85,47.15 T3:T2.1 | T2:R5.P$2 71.5,44.95 | 77.57,44.95 77.62,45
  Top 0.6: 60.04,59.9 T3:R4.2 60.04,56.48 | T3:W2.2 60.05,60.75 59.19,61.61 T3:Q1.2 | T3:Q2.2 61.23,55.29 61.24,55.29 61.9,54.63 61.9,52.9 | 61.9,52.9 61.9,51.4 59.15,48.65 T3:C2.1 | 71.35,45.1 71.5,44.95 | 77.46,45.54 76.87,44.95 T2:R5.P$2 T2:C1.1 71.35,50.15 68.6,52.9 61.9,52.9
  Bottom 0.2: v67.5,46.7 66.76,45.96 66.19,45.96 62.19,41.96 v62.19,36.3
V_BAT_SENSE+
  Top 0.2: B1:R6.1 25.3,55.47 25.63,55.8 B1:Q1.2 25.63,57.27 24.8,58.1 24.1,58.1 23.6,58.6 23.6,62.4 26.2,65 JP3.3
V_BAT_SENSE-
  Top 0.2: B1:R1.1 29.25,63.7 27.7,63.7 26.6,64.8 26.6,70.7 27.3,71.4 27.3,72.27 26.62,72.94 25.78,72.94 24.66,71.83 JP3.5
V_LED+
  Top 0.2: 81.81,37.36 JP4.1 | T2:R6.2 76.35,34.35 76.7,34.7
  Top 0.6: T2:R3.C 76.7,34.7 T2:C2.1 79.15,35.15 81.36,37.36 JP4.1 JP4.2
V_LED-
  Top 0.2: T2:B1.2 77.62,40.9 77.62,40.98 77.62,41.48 77.2,41.9 66.31,41.9 65.56,42.65 T2:T1.3
  Top 0.4: JP4.4
  Top 0.6: JP4.4 JP4.3 T2:B1.2
V_SENSOR
  Top 0.2: B3:R1.1 37.25,63.9 34.46,63.9 33.16,65.2 30.5,65.2 29.8,65.91 29.8,73.31 JP3.2
VDD_SENSOR
  Top 0.2: R1.C 32.99,64.8 30.33,64.8 29.35,65.78 29.35,69.9 28.74,70.51 JP3.1

### Text on the board
tStop: DevBoard v0.0 | BAT | 5V | CHG | I_MEAS | U_MEAS | T_MEAS | V+ | 3V3 | LED | FN | 2V5 | RST | EXP | PGM